# EAGLE design logger_2G_GSM (EAGLE 6.6.0)
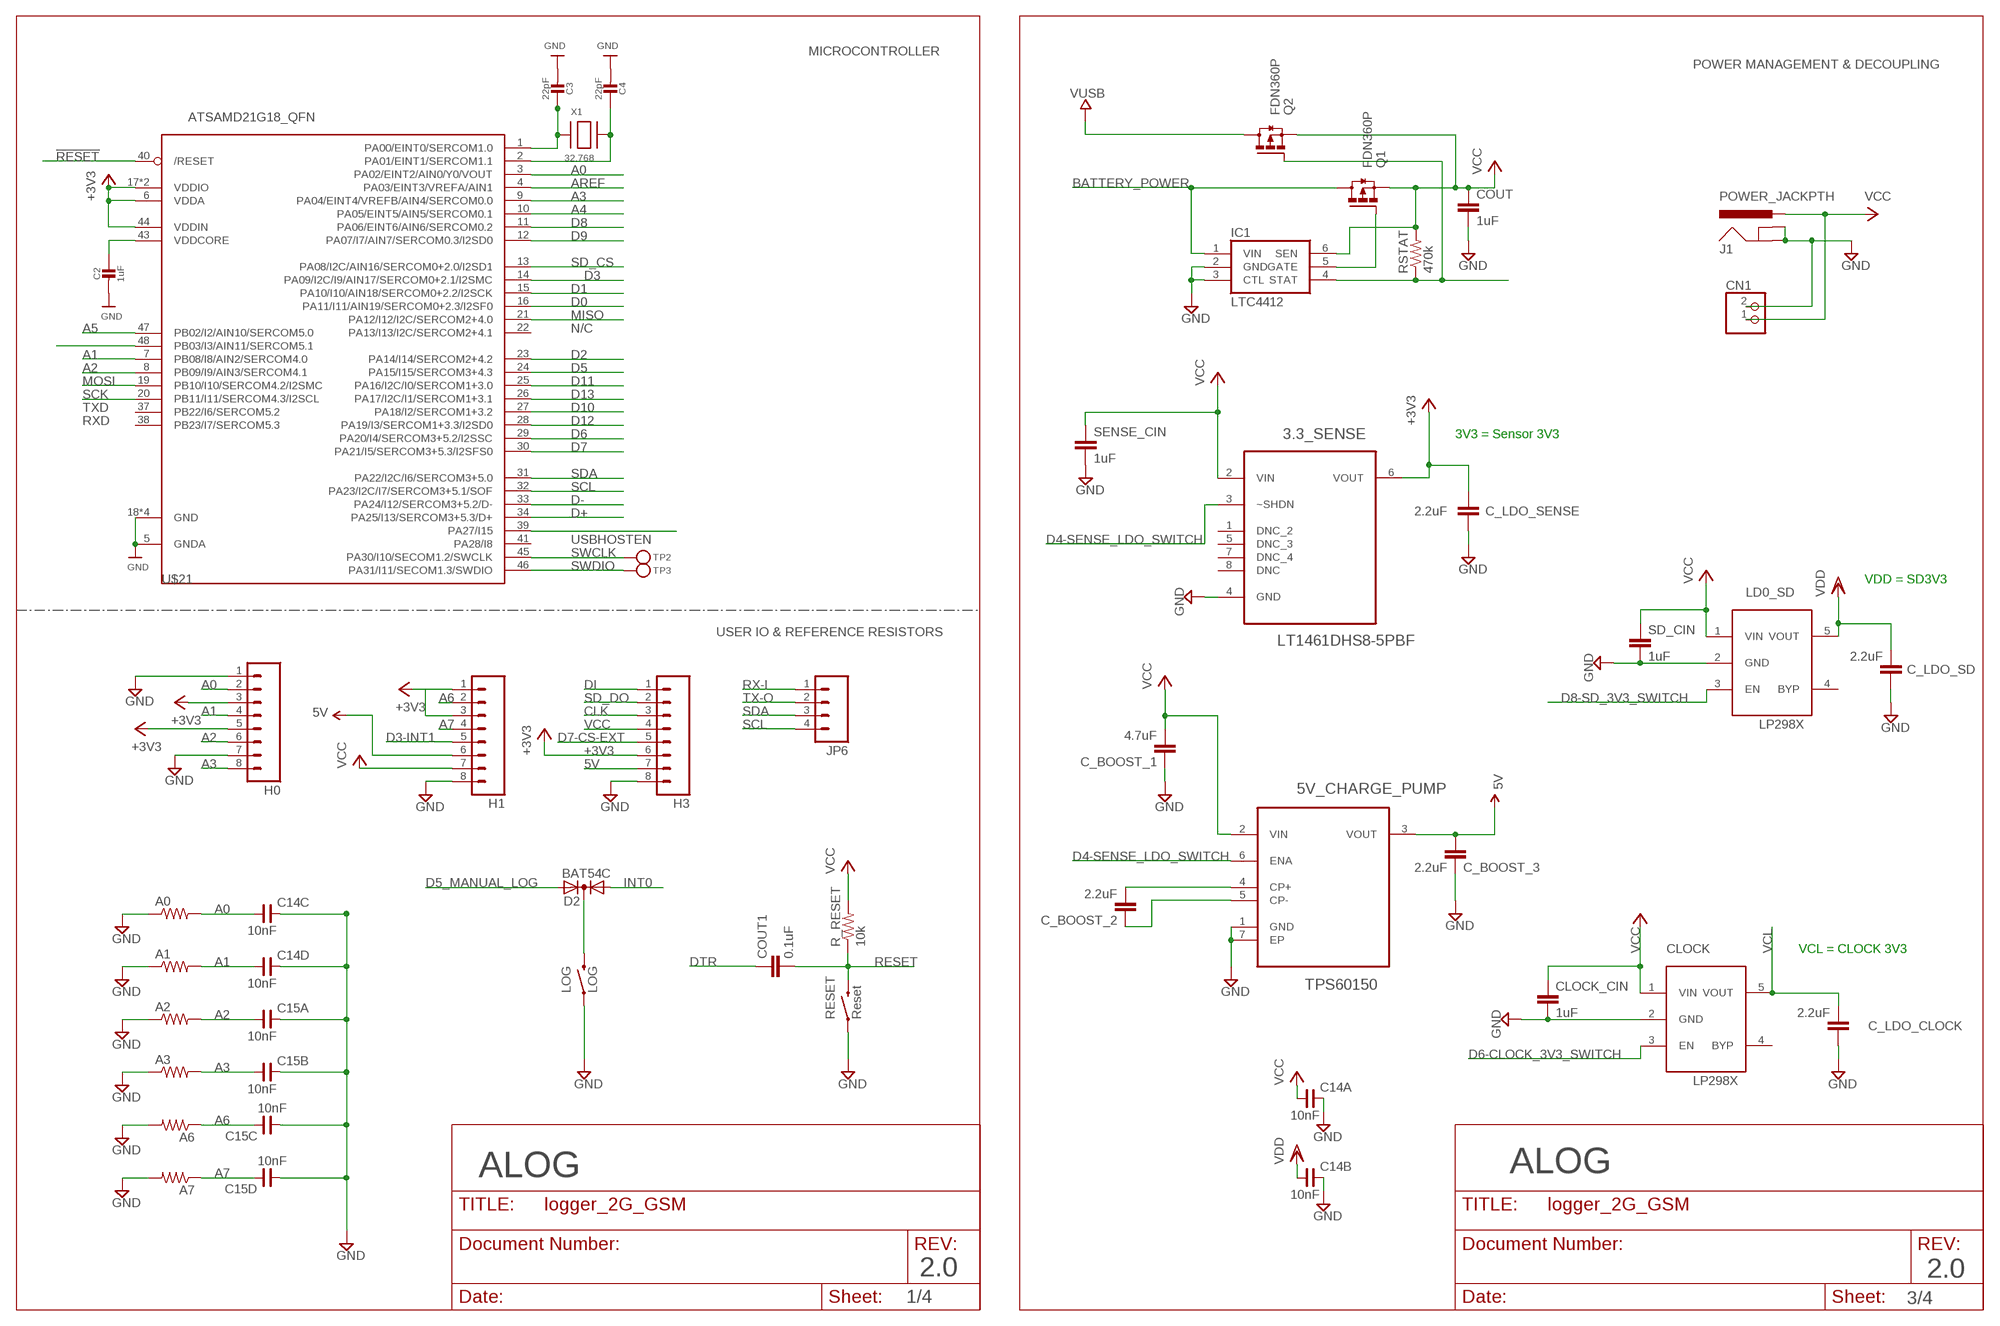
[diagram p0: schematic, sheet 1, part 1 of 3]
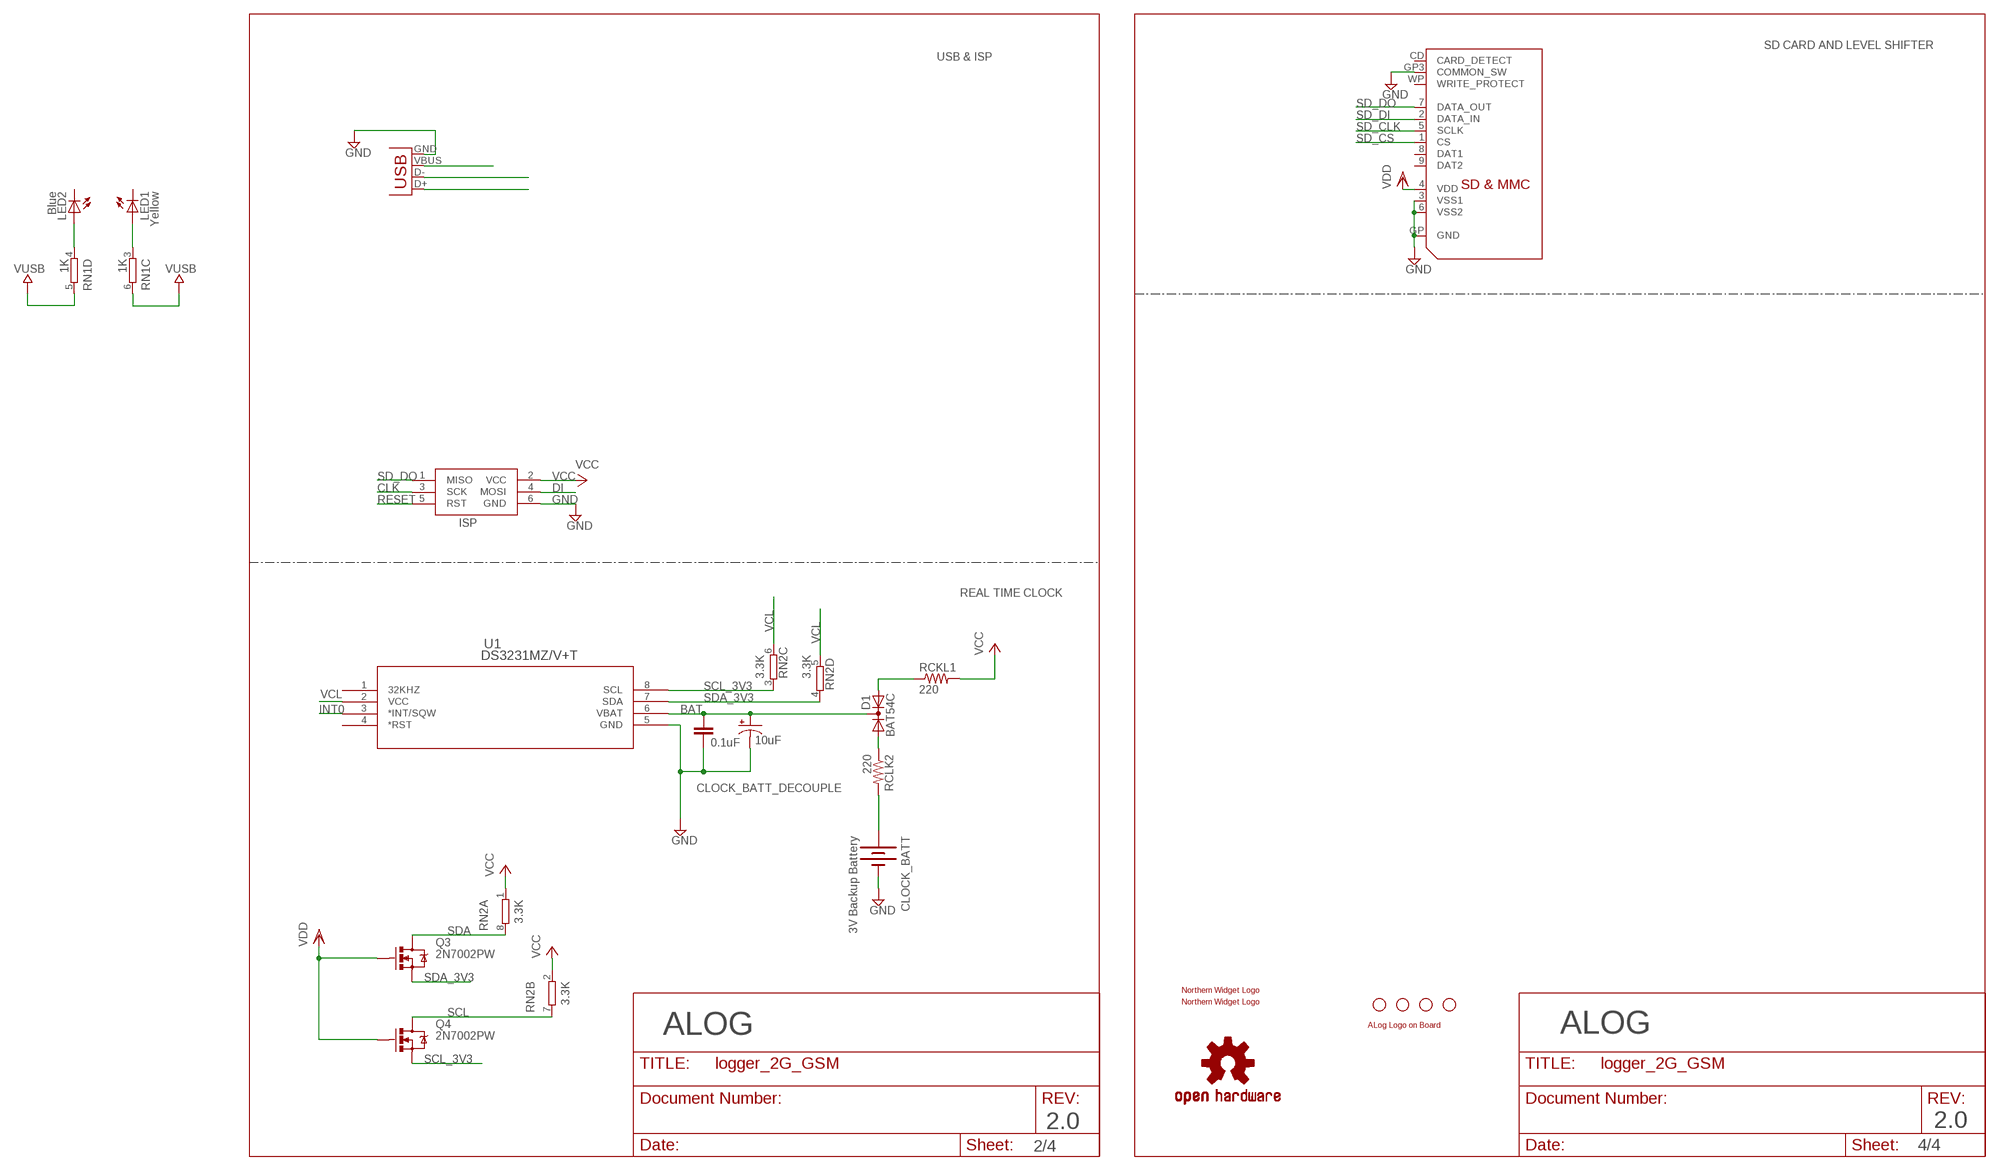
[diagram p1: schematic, sheet 1, part 2 of 3]
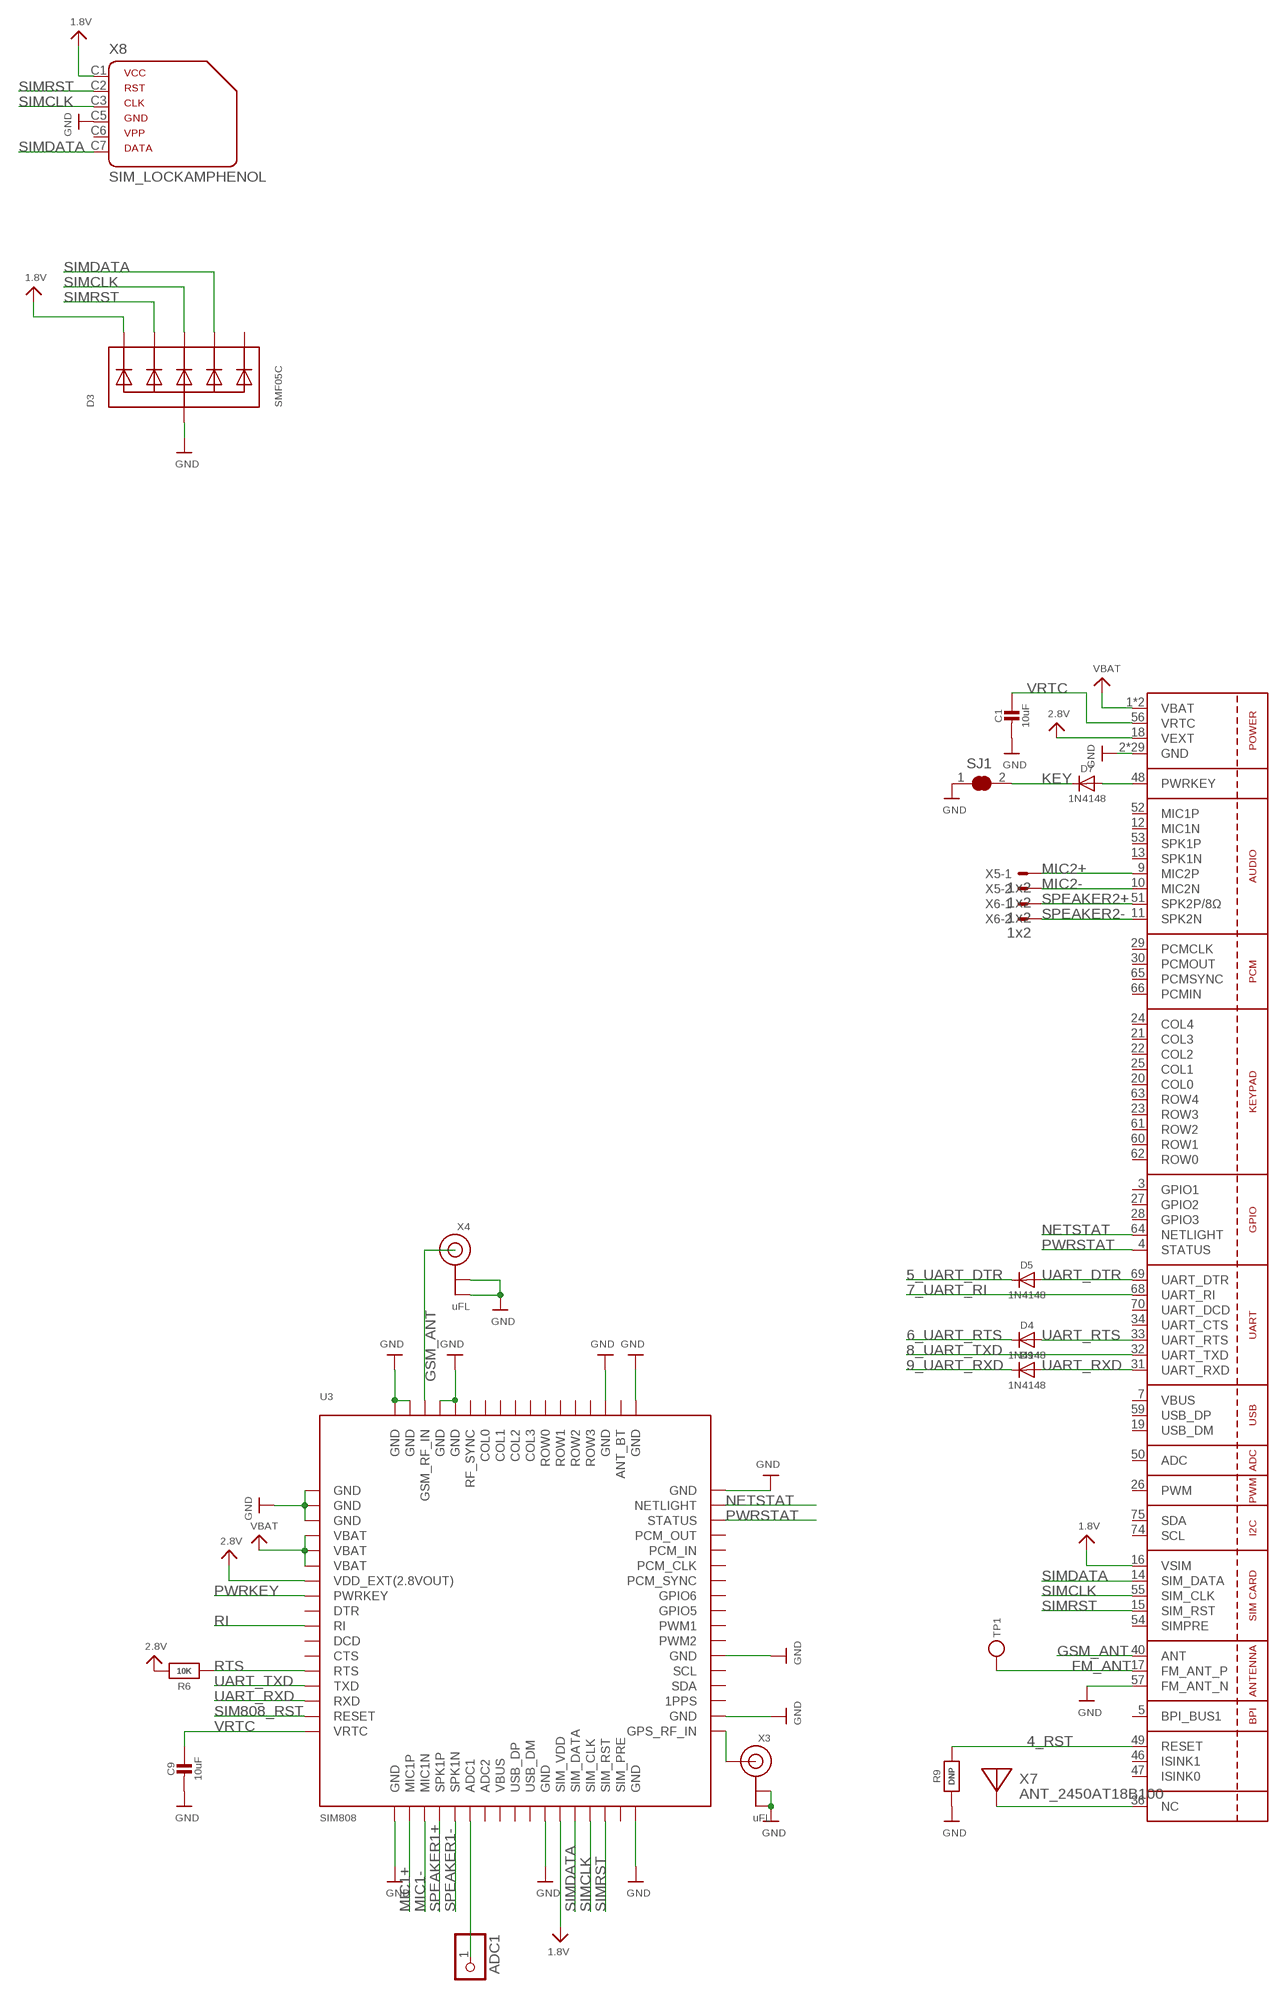
[diagram p2: schematic, sheet 1, part 3 of 3]

## Parts
3.3_SENSE  LT1461DHS8-5PBF  [SOIC127P600X175-8N]
5V_CHARGE_PUMP  TPS60150  TPS60150DRVR  [SON65P200X200X80-7N]
A0  R-US_0207/10  [0207/10]
A1  R-US_0207/10  [0207/10]
A2  R-US_0207/10  [0207/10]
A3  R-US_0207/10  [0207/10]
A6  R-US_0207/10  [0207/10]
A7  R-US_0207/10  [0207/10]
ADC1  PINHD-1X1CB  [1X01-CLEANBIG]
C1  10uF  CAP_CERAMIC_0805MP  [_0805MP]
C2  1uF  CAP_CERAMIC0603_NO  [0603-NO]
C3  22pF  CAP_CERAMIC0603_NO  [0603-NO]
C4  22pF  CAP_CERAMIC0603_NO  [0603-NO]
C9  10uF  CAP_CERAMIC0805-NOOUTLINE  [0805-NO]
C14  10nF  CCA_ECJ-1206  [CECJ-1206]
C15  10nF  CCA_ECJ-1206  [CECJ-1206]
C_BOOST_1  4.7uF  C-EUC0603  [C0603]
C_BOOST_2  2.2uF  C-EUC0603  [C0603]
C_BOOST_3  2.2uF  C-EUC0603  [C0603]
C_LDO_CLOCK  2.2uF  C-EUC0603  [C0603]
C_LDO_SD  2.2uF  C-EUC0603  [C0603]
C_LDO_SENSE  2.2uF  C-EUC0603  [C0603]
CLOCK  LP2985  LP298XS  [SOT23-5L]
CLOCK_BATT  3V Backup Battery  BATTERY12PTH  [BATTCON_12MM_PTH]
CLOCK_BATT_DECOUP  0.1uF  C-EUC0603  [C0603]
CLOCK_BATT_DECOUPLE  10uF  CAP_POL1206  [EIA3216]
CLOCK_CIN  1uF  C-EUC0603  [C0603]
CN1  JST_2PIN-THM  [JST-PH-2-THM]
COUT  1uF  C-EUC0603  [C0603]
COUT1  0.1uF  C-EUC0603  [C0603]
D1  BAT54C  DIODE_AC-CA_  [SOT23C]
D2  BAT54C  DIODE_AC-CA_  [SOT23C]
D3  SMF05C  TVSARRAY_5LANE  [SOT363]
D4  1N4148  DIODESOD-323  [SOD-323]
D5  1N4148  DIODESOD-323  [SOD-323]
D7  1N4148  DIODESOD-323  [SOD-323]
D9  1N4148  DIODESOD-323  [SOD-323]
H0  M083.5MM-8  [SCREWTERMINAL-3.5MM-8]
H1  M083.5MM-8  [SCREWTERMINAL-3.5MM-8]
H3  M083.5MM-8  [SCREWTERMINAL-3.5MM-8]
IC1  LTC4412  LTC4412ES6  [TSOT23-6]
ISP  AVRISP-6  [AVRISP]
J1  POWER_JACKPTH  [POWER_JACK_PTH]
JP1  STAND-OFF  [STAND-OFF]
JP2  STAND-OFF  [STAND-OFF]
JP3  STAND-OFF  [STAND-OFF]
JP4  STAND-OFF  [STAND-OFF]
JP5  USB-B  USBPTH  [USB-B-PTH]
JP6  M04SCREW  [SCREWTERMINAL-3.5MM-4]
LD0_SD  LP2985  LP298XS  [SOT23-5L]
LED1  Yellow  LED0603  [LED-0603]
LED2  Blue  LED0603  [LED-0603]
LOG  LOG  SWITCH-MOMENTARY-2PTH  [TACTILE-PTH]
LOGO1  OSHW-LOGOM  [OSHW-LOGO-M]
Q1  FDN360P  [SUPER-SOT3]
Q2  FDN360P  [SUPER-SOT3]
Q3  2N7002PW  MOSFET-NCHANNELSOT323  [SOT323]
Q4  2N7002PW  MOSFET-NCHANNELSOT323  [SOT323]
R6  10K  RESISTOR0805_NOOUTLINE  [0805-NO]
R9  DNP  RESISTOR_0603_NOOUT  [0603-NO]
R_RESET  10k  R-US_R0603  [R0603]
RCKL1  220  R-US_R0603  [R0603]
RCLK2  220  R-US_R0603  [R0603]
RESET  Reset  SWITCH-MOMENTARY-2PTH  [TACTILE-PTH]
RN1  1K  4R-N0603-ARC  [0603-ARC]
RN2  3.3K  4R-N0603-ARC  [0603-ARC]
RSTAT  470k  R-US_R0603  [R0603]
SD  SDMMC06132  [06132]
SD_CIN  1uF  C-EUC0603  [C0603]
SENSE_CIN  1uF  C-EUC0603  [C0603]
SJ1  SOLDERJUMPER_CLOSED  [SOLDERJUMPER_CLOSEDWIRE]
TP1  TESTPOINTROUND1.5MM  [TESTPOINT_ROUND_1.5MM]
TP2  TESTPOINTROUND1.5MM  [TESTPOINT_ROUND_1.5MM]
TP3  TESTPOINTROUND1.5MM  [TESTPOINT_ROUND_1.5MM]
U1  DS3231MZ/V+T  [21-0041B_8]
U2  SIM800H/L  GSM_SIM800L  [SIM800L]
U3  SIM808  GSM_SIM808_LITERAL  [SIM900_SMT]
U$1  NWLOGO  [NWLOGO]
U$2  ALOG_LOGO_V1_5.5MM  [ALOG_LOGO_V1_SMALL]
U$3  NWLOGO_MED  [NWLOGO_MED]
U$21  ATSAMD21G18_QFN  ATSAMD21J_QFN  [TQFN48_7MM]
X1  32.768  XTAL-3.2X1.5  [XTAL3215]
X3  uFL  ANTENNA_U.FL  [U.FL]
X4  uFL  ANTENNA_U.FL  [U.FL]
X5  1x2  87758-0216  [87758-0216]
X6  1x2  87758-0216  [87758-0216]
X7  ANT_2450AT18B100  ANTENNA_JOHANSON_2450AT18B100  [ANT_2450AT18B100]
X8  SIM_LOCKAMPHENOL  [C707_10M006_512_2]

## Nets
1.8V: D3.1(C1) U2.16(VSIM) U3.P$29(SIM_VDD) X8.C1
2.8V: R6.2 U2.18(VEXT) U3.P$7(VDD_EXT(2.8VOUT))
4_RST: R9.2 U2.49(RESET)
5_UART_DTR: D5.C
5V: 5V_CHARGE_PUMP.3(VOUT) C_BOOST_3.2 H1.6 H3.7
6_UART_RTS: D4.C
7_UART_RI: U2.68(UART_RI)
8_UART_TXD: U2.32(UART_TXD)
9_UART_RXD: D9.C
!RESET: U$21.40(/RESET)
+3V3: 3.3_SENSE.6(VOUT) C_LDO_SENSE.2 H0.3 H0.5 H1.1 H1.3 H3.6 U$21.6(VDDA) U$21.17(VDDIO) U$21.36(VDDIO) U$21.44(VDDIN)
A0: A0.2 C14.C1 H0.2 U$21.3(PA02/EINT2/AIN0/Y0/VOUT)
A1: A1.2 C14.D1 H0.4 U$21.7(PB08/I8/AIN2/SERCOM4.0)
A2: A2.2 C15.A1 H0.6 U$21.8(PB09/I9/AIN3/SERCOM4.1)
A3: A3.2 C15.B1 H0.8 U$21.9(PA04/EINT4/VREFB/AIN4/SERCOM0.0)
A4: U$21.10(PA05/EINT5/AIN5/SERCOM0.1)
A5: U$21.47(PB02/I2/AIN10/SERCOM5.0)
A6: A6.1 C15.C2 H1.2
A7: A7.1 C15.D2 H1.4
AREF: U$21.4(PA03/EINT3/VREFA/AIN1)
BAT: CLOCK_BATT_DECOUP.1 CLOCK_BATT_DECOUPLE.A(+) D1.3(K) U1.6(VBAT)
BATTERY_POWER: IC1.1(VIN) Q1.3(D)
CLK: H3.3 ISP.3(SCK)
D0: U$21.16(PA11/I11/AIN19/SERCOM0+2.3/I2SF0)
D1: U$21.15(PA10/I10/AIN18/SERCOM0+2.2/I2SCK)
D2: U$21.23(PA14/I14/SERCOM2+4.2)
D3: U$21.14(PA09/I2C/I9/AIN17/SERCOM0+2.1/I2SMC)
D3-INT1: H1.5
D4-SENSE_LDO_SWITCH: 3.3_SENSE.3(~SHDN) 5V_CHARGE_PUMP.6(ENA)
D5: U$21.24(PA15/I15/SERCOM3+4.3)
D5_MANUAL_LOG: D2.2(A2)
D6: U$21.29(PA20/I4/SERCOM3+5.2/I2SSC)
D6-CLOCK_3V3_SWITCH: CLOCK.3(EN)
D7: U$21.30(PA21/I5/SERCOM3+5.3/I2SFS0)
D7-CS-EXT: H3.5
D8: U$21.11(PA06/EINT6/AIN6/SERCOM0.2)
D8-SD_3V3_SWITCH: LD0_SD.3(EN)
D9: U$21.12(PA07/I7/AIN7/SERCOM0.3/I2SD0)
D10: U$21.27(PA18/I2/SERCOM1+3.2)
D11: U$21.25(PA16/I2C/I0/SERCOM1+3.0)
D12: U$21.28(PA19/I3/SERCOM1+3.3/I2SD0)
D13: U$21.26(PA17/I2C/I1/SERCOM1+3.1)
D+: U$21.34(PA25/I13/SERCOM3+5.3/D+)
D-: U$21.33(PA24/I12/SERCOM3+5.2/D-)
DI: H3.1 ISP.4(MOSI)
DTR: COUT1.1
FM_ANT: TP1.P$1 U2.17(FM_ANT_P)
GND: 3.3_SENSE.4(GND) 5V_CHARGE_PUMP.1(GND) 5V_CHARGE_PUMP.7(EP) A0.1 A1.1 A2.1 A3.1 A6.2 A7.2 C1.2 C2.2 C3.2 C4.2 C9.2 C14.A2 C14.B2 C14.C2 C14.D2 C15.A2 C15.B2 C15.C1 C15.D1 C_BOOST_1.1 C_BOOST_3.1 C_LDO_CLOCK.1 C_LDO_SD.1 C_LDO_SENSE.1 CLOCK.2(GND) CLOCK_BATT.GND(-) CLOCK_BATT_DECOUP.2 CLOCK_BATT_DECOUPLE.C(-) CLOCK_CIN.2 CN1.2 COUT.2 D3.2(A) H0.1 H0.7 H1.8 H3.8 IC1.2(GND) IC1.3(CTL) ISP.6(GND) J1.GND J1.GNDBREAK JP5.GND LD0_SD.2(GND) LOG.1 R9.1 RESET.1 SD.3(VSS1) SD.6(VSS2) SD.GP3(COMMON_SW) SD.GP(GND) SD_CIN.2 SENSE_CIN.2 SJ1.1 U1.5(GND) U2.2(GND) U2.6(GND) U2.8(GND) U2.35(GND) U2.37(GND) U2.38(GND) U2.39(GND) U2.41(GND) U2.43(GND) U2.44(GND) U2.45(GND) U2.57(FM_ANT_N) U2.58(GND) U2.67(GND) U2.71(GND) U2.72(GND) U2.73(GND) U2.76(GND) U2.77(GND) U2.78(GND) U2.79(GND) U2.80(GND) U2.81(GND) U2.82(GND) U2.83(GND) U2.84(GND) U2.85(GND) U2.86(GND) U2.87(GND) U2.88(GND) U3.P$1(GND) U3.P$2(GND) U3.P$3(GND) U3.P$18(GND) U3.P$28(GND) U3.P$34(GND) U3.P$36(GND) U3.P$40(GND) U3.P$51(GND) U3.P$52(GND) U3.P$54(GND) U3.P$64(GND) U3.P$65(GND) U3.P$67(GND) U3.P$68(GND) U$21.5(GNDA) U$21.18(GND) U$21.35(GND) U$21.42(GND) U$21.THERMAL(GND) X3.1(GND) X3.2(GND) X4.1(GND) X4.2(GND) X8.C5
GSM_ANT: U2.40(ANT) U3.P$66(GSM_RF_IN) X4.3(SIGNAL)
INT0: D2.1(A1) U1.3(*INT/SQW)
KEY: D7.C SJ1.2
MIC1+: U3.P$19(MIC1P)
MIC1-: U3.P$20(MIC1N)
MIC2+: U2.9(MIC2P) X5.1
MIC2-: U2.10(MIC2N) X5.2
MISO: U$21.21(PA12/I12/I2C/SERCOM2+4.0)
MOSI: U$21.19(PB10/I10/SERCOM4.2/I2SMC)
N$1: D1.1(A1) RCLK2.1
N$2: CLOCK_BATT.VCC@1(+) RCLK2.2
N$3: JP5.D+
N$4: JP5.D-
N$5: LED2.A RN1.4
N$6: U3.P$35(GPS_RF_IN) X3.3(SIGNAL)
N$7: IC1.4(STAT) Q2.1(G) RSTAT.1
N$8: IC1.5(GATE) Q1.1(G)
N$9: LED1.A RN1.3
N$10: ADC1.1 U3.P$23(ADC1)
N$11: D2.3(K) LOG.3
N$13: U2.36(NC) X7.FP
N$14: 5V_CHARGE_PUMP.4(CP+) C_BOOST_2.2
N$15: 5V_CHARGE_PUMP.5(CP-) C_BOOST_2.1
N$16: D7.A U2.48(PWRKEY)
N$17: C3.1 U$21.1(PA00/EINT0/SERCOM1.0) X1.P$1
N$18: JP5.VBUS
N$19: C4.1 U$21.2(PA01/EINT1/SERCOM1.1) X1.P$2
N$20: U$21.48(PB03/I3/AIN11/SERCOM5.1)
N$21: U$21.39(PA27/I15)
N$67: D1.2(A2) RCKL1.1
NETSTAT: U2.64(NETLIGHT) U3.P$50(NETLIGHT)
PWRKEY: U3.P$8(PWRKEY)
PWRSTAT: U2.4(STATUS) U3.P$49(STATUS)
RESET: COUT1.2 ISP.5(RST) R_RESET.1 RESET.3
RI: U3.P$10(RI)
RTS: R6.1 U3.P$13(RTS)
RX-I: JP6.1
SCK: U$21.20(PB11/I11/SERCOM4.3/I2SCL)
SCL: JP6.4 Q4.3(D) RN2.7 U$21.32(PA23/I2C/I7/SERCOM3+5.1/SOF)
SCL_3V3: Q4.2(S) RN2.3 U1.8(SCL)
SD_CLK: SD.5(SCLK)
SD_CS: SD.1(CS) U$21.13(PA08/I2C/AIN16/SERCOM0+2.0/I2SD1)
SD_DI: SD.2(DATA_IN)
SD_DO: H3.2 ISP.1(MISO) SD.7(DATA_OUT)
SDA: JP6.3 Q3.3(D) RN2.8 U$21.31(PA22/I2C/I6/SERCOM3+5.0)
SDA_3V3: Q3.2(S) RN2.4 U1.7(SDA)
SIM808_RST: U3.P$16(RESET)
SIMCLK: D3.4(C3) U2.55(SIM_CLK) U3.P$31(SIM_CLK) X8.C3
SIMDATA: D3.5(C4) U2.14(SIM_DATA) U3.P$30(SIM_DATA) X8.C7
SIMRST: D3.3(C2) U2.15(SIM_RST) U3.P$32(SIM_RST) X8.C2
SPEAKER1+: U3.P$21(SPK1P)
SPEAKER1-: U3.P$22(SPK1N)
SPEAKER2+: U2.51(SPK2P/8Ω) X6.1
SPEAKER2-: U2.11(SPK2N) X6.2
SWCLK: TP2.P$1 U$21.45(PA30/I10/SECOM1.2/SWCLK)
SWDIO: TP3.P$1 U$21.46(PA31/I11/SECOM1.3/SWDIO)
TX-O: JP6.2
UART_DTR: D5.A U2.69(UART_DTR)
UART_RTS: D4.A U2.33(UART_RTS)
UART_RXD: D9.A U2.31(UART_RXD) U3.P$15(RXD)
UART_TXD: U3.P$14(TXD)
VBAT: U2.1(VBAT) U2.42(VBAT) U3.P$4(VBAT) U3.P$5(VBAT) U3.P$6(VBAT)
VCC: 3.3_SENSE.2(VIN) 5V_CHARGE_PUMP.2(VIN) C14.A1 C_BOOST_1.2 CLOCK.1(VIN) CLOCK_CIN.1 CN1.1 COUT.1 H1.7 H3.4 IC1.6(SEN) ISP.2(VCC) J1.PWR LD0_SD.1(VIN) Q1.2(S) Q2.2(S) R_RESET.2 RCKL1.2 RN2.1 RN2.2 RSTAT.2 SD_CIN.1 SENSE_CIN.1
VCL: C_LDO_CLOCK.2 CLOCK.5(VOUT) RN2.5 RN2.6 U1.2(VCC)
VDD: C14.B1 C_LDO_SD.2 LD0_SD.5(VOUT) Q3.1(G) Q4.1(G) SD.4(VDD)
VDDCORE: C2.1 U$21.43(VDDCORE)
VRTC: C1.1 C9.1 U2.56(VRTC) U3.P$17(VRTC)
VUSB: Q2.3(D) RN1.5 RN1.6
Unconnected: 3.3_SENSE.1(DNC_2) 3.3_SENSE.5(DNC_3) 3.3_SENSE.7(DNC_4) 3.3_SENSE.8(DNC) CLOCK.4(BYP) D3.6(C5) LD0_SD.4(BYP) LED1.C LED2.C RN1.1 RN1.2 RN1.7 RN1.8 SD.8(DAT1) SD.9(DAT2) SD.CD(CARD_DETECT) SD.WP(WRITE_PROTECT) U1.1(32KHZ) U1.4(*RST) U2.3(GPIO1) U2.5(BPI_BUS1) U2.12(MIC1N) U2.13(SPK1N) U2.19(USB_DM) U2.20(COL0) U2.21(COL3) U2.22(COL2) U2.23(ROW3) U2.24(COL4) U2.25(COL1) U2.26(PWM) U2.27(GPIO2) U2.28(GPIO3) U2.29(PCMCLK) U2.30(PCMOUT) U2.34(UART_CTS) U2.46(ISINK1) U2.47(ISINK0) U2.50(ADC) U2.52(MIC1P) U2.53(SPK1P) U2.54(SIMPRE) U2.59(USB_DP) U2.60(ROW1) U2.61(ROW2) U2.62(ROW0) U2.63(ROW4) U2.65(PCMSYNC) U2.66(PCMIN) U2.70(UART_DCD) U2.74(SCL) U2.75(SDA) U3.P$9(DTR) U3.P$11(DCD) U3.P$12(CTS) U3.P$24(ADC2) U3.P$26(USB_DP) U3.P$27(USB_DM) U3.P$33(SIM_PRE) U3.P$37(1PPS) U3.P$38(SDA) U3.P$39(SCL) U3.P$41(PWM2) U3.P$42(PWM1) U3.P$43(GPIO5) U3.P$44(GPIO6) U3.P$45(PCM_SYNC) U3.P$46(PCM_CLK) U3.P$47(PCM_IN) U3.P$48(PCM_OUT) U3.P$53(ANT_BT) U3.P$55(ROW3) U3.P$56(ROW2) U3.P$57(ROW1) U3.P$58(ROW0) U3.P$59(COL3) U3.P$60(COL2) U3.P$61(COL1) U3.P$62(COL0) U3.P$63(RF_SYNC) U$21.22(PA13/I13/I2C/SERCOM2+4.1) U$21.37(PB22/I6/SERCOM5.2) U$21.38(PB23/I7/SERCOM5.3) U$21.41(PA28/I8) X8.C6

## Notes on the sheet
- MICROCONTROLLER
- POWER MANAGEMENT & DECOUPLING
- N/C
- TXD
- RXD
- 3V3 = Sensor 3V3
- USBHOSTEN
- VDD = SD3V3
- USER IO & REFERENCE RESISTORS
- VCL = CLOCK 3V3
- ALOG | ALOG
- 2.0 | 2.0
- 1/4 | 3/4
- SD CARD AND LEVEL SHIFTER
- USB & ISP
- REAL TIME CLOCK
- ALOG | ALOG
- 2.0 | 2.0
- 2/4 | 4/4

## Power pins joined to a net without a drawn wire
VBUS: U2.7(VBUS) U3.P$25(VBUS)

## Library data of the parts
3.3_SENSE = LTC_By_element14_Batch_1:LT1461DHS8-5PBF: Micropower Precision Low Dropout Series Voltage Reference Family; MPN: LT1461DHS8-5#PBF; OC_FARNELL: 1663431; OC_NEWARK: 57M4326; PACKAGE: SOIC-8; SUPPLIER: Linear Technology
5V_CHARGE_PUMP = ti_by_element14:TPS60150DRVR: Charge Pump Device; MPN: TPS60150DRVR; OC_FARNELL: -; OC_NEWARK: 45P8283; PACKAGE: SON-6; SUPPLIER: Texas Instruments
A0 A1-A3 A6 A7 = resistor:R-US_: RESISTOR, American symbol
ADC1 = adafruit:PINHD-1X1: Pin header 1x1 for 0.1" spacing With round pins
C1-C4 C9 = microbuilder:CAP_CERAMIC: Ceramic Capacitors For new designs, use the packages preceded by an '_' character since they are more reliable: The following footprints should be used on most boards: _0402 - Standard footprint for regular board layouts _0603 - Standard footprint for regular board layouts _0805 - Standard footprint for regular board layouts _1206 - Standard footprint for regular board layouts For extremely tight-pitch boards where space is at a premium, the following 'micro-pitch' footprints can be used (smaller pads, no silkscreen outline, etc.): _0402MP - Micro-pitch footprint for very dense/compact boards _0603MP - Micro-pitch footprint for very dense/compact boards _0805MP - Micro-pitch footprint for very dense/compact boards _1206MP - Micro-pitch footprint for very dense/compact boards
C14 C15 = rc-master-smd:CCA_: CHIP CAP ARRAY
C_BOOST_1-C_BOOST_3 C_LDO_CLOCK C_LDO_SD C_LDO_SENSE = resistor:C-EU: CAPACITOR, European symbol
CLOCK LD0_SD = adafruit:LP298X
CLOCK_BATT = SparkFun:BATTERY: Battery Holders Various common sizes : AA, AAA, 20mm coin cell and 12mm coin cell.
CLOCK_BATT_DECOUP CLOCK_CIN COUT COUT1 SD_CIN SENSE_CIN = rcl:C-EU: CAPACITOR, European symbol
CLOCK_BATT_DECOUPLE = SparkFun-Passives:CAP_POL: Capacitor Polarized These are standard SMD and PTH capacitors. Normally 10uF, 47uF, and 100uF in electrolytic and tantalum varieties. Always verify the external diameter of the through hole cap, it varies with capacity, voltage, and manufacturer. The EIA devices should be standard.
CN1 = adafruit:JST_2PIN: JST 2-Pin Connectors of various flavors SMT-RA (S2B-PH-SM4) 4UConnector #17311 SMT (B2B-PH-SM4) THM-RA (S2B-PH) THM (B2B-PH)
D1 D2 = semicon-smd-ipc:DIODE_AC-CA_: DUAL DIODE
D3 = microbuilder:TVSARRAY_5LANE: Voltage Transient Suppressor Array SOT363 SMF05C - 100W 5V: Digikey - SMF05CT1GOSCT-ND
D4 D5 D7 D9 = microbuilder:DIODE: Diode SMA Model Volts Amps Type Vf Ir Digikey # Notes SSA34-E3 40V 3A Schottky 480mV @ 3A 200uA @ 40V SSA34-E3/61TGITR-ND CDBA120-G 20V 1A Schottky 500mV @ 1A 500uA @ 20V 641-1014-6-ND REEL MBRA210 10V 2A Schottky 350mV @ 2A 700uA @ 10V MBRA210LT3 SOD-123 Model Volts Amps Type Vf Ir Order # Notes BAT54T1G 30V 200mA Schottky 800mV @ 200mA 2uA @ 25V BAT54T1GOSTR-ND B0530W 30V 500mA Schottky 430mV @ 500mA 130uA @ 30V B0530W-FDICT-ND REEL MBR120 20V 1A Schottky 340mV @ 1A MBR120VLSFT1GOSCT-ND SOD-323 Model Volts Amps Type Vf Ir Order # Notes PMEG2005EJ 20V 500mA Schottky 355mV @ 500mA 568-4110-1-ND ZLLS410 10V 570mA Schottky 380mV @ 570mA ZLLS410CT-ND 1N4148WS 75V 150mA Silicon/Simple 1V 1N4148WSFSCT-ND REEL SOD-523 Model Volts Amps Type Vf Ir Order # Notes BAT54XV2 30V 200mA Schottky 0.8V @ 100mA BAT54XV2CT-ND TB751S 30V 30mA Schottky RB751S-40TE61CT-ND SOT23-R/W (R = Solder Paste/Reflow Ovens, W = Hand-Soldering) Model Volts Amps Type Vf Ir Order # Notes BAT54FILM 40V 300mA Schottky 497-7162-1-ND POWERDI-5 Model Volts Amps Type Vf Ir Order # Notes PDS560 60V 5A Schottky 670mV @ 5A 150uA @ 60V PDS560DICT-ND
H0 H1 H3 = SparkFun:M08: Header 8 Standard 8-pin 0.1" header. Use with straight break away headers (SKU : PRT-00116), right angle break away headers (PRT-00553), swiss pins (PRT-00743), machine pins (PRT-00117), and female headers (PRT-00115).
IC1 = awickert:LTC4412*: Low Loss PowerPath Controller
ISP = adafruit:AVRISP: AVR ISP HEADER Standard 6 pin header for AVR programming
J1 = SparkFun:POWER_JACK: Power Jack This is the standard 5.5mm barrel jack for power. The PTH is the most common, proven, reliable, footprint. All others are experimental. The Slot footprint only works if the mill layer is transmitted to the PCB fab house so be warned. Spark Fun Electronics SKU : PRT-00119. Mating wall wart : TOL-00298 (and others)
JP1-JP4 = SparkFun:STAND-OFF: Stand Off This is the mechanical footprint for a #4 phillips button head screw. Use the keepout ring to avoid running the screw head into surrounding components. SKU : PRT-00447
JP5 = SparkFun-Connectors:USB: USB Connectors USB-B-PTH is fully proven SKU : PRT-00139/CONN-08278 USB-miniB is fully proven SKU : PRT-00587 USB-A-PCB is untested. USB-A-H is throughly reviewed, but untested. Spark Fun Electronics SKU : PRT-00437 USB-B-SMT is throughly reviewed, but untested. Needs silkscreen touching up. USB-A-S has not been used/tested USB-MB-H has not been used/tested USB-MICROB has been used. CONN-09505; PROD_ID: CONN-08278
JP6 = SparkFun-Connectors:M04: Header 4 Standard 4-pin 0.1" header. Use with straight break away headers (SKU : PRT-00116), right angle break away headers (PRT-00553), swiss pins (PRT-00743), machine pins (PRT-00117), and female headers (PRT-00115). Molex polarized connector foot print use with SKU : PRT-08231 with associated crimp pins and housings. 1MM SMD Version SKU: PRT-10208; PROD_ID: Combine 2x8399
LED1 LED2 = SparkFun-LED:LED: LEDs Standard schematic elements and footprints for 5mm, 3mm, 1206, and 0603 sized LEDs. 5mm - Spark Fun Electronics SKU : COM-00529 (and others)
LOG RESET = SparkFun-Electromechanical:SWITCH-MOMENTARY-2: Various NO switches- pushbuttons, reed, etc; PROD_ID: SWCH-08441
LOGO1 = SparkFun-Aesthetics:OSHW-LOGO: Open Source Hardware Logo This logo indicates the piece of hardware it is found on incorporates a OSHW license and/or adheres to the definition of open source hardware found here: http://freedomdefined.org/OSHW
Q1 Q2 = transistor-power:FDN360P: Single P-Channel, PowerTrench (R) MOSFET Source: http://www.fairchildsemi.com/ds/FD/FDN360P.pdf
Q3 Q4 = SparkFun-DiscreteSemi:MOSFET-NCHANNEL: Generic NMOS footprint
R6 R9 = microbuilder:RESISTOR: Resistors For new designs, use the packages preceded by an '_' character since they are more reliable: The following footprints should be used on most boards: _0402 - Standard footprint for regular board layouts _0603 - Standard footprint for regular board layouts _0805 - Standard footprint for regular board layouts _1206 - Standard footprint for regular board layouts For extremely tight-pitch boards where space is at a premium, the following 'micro-pitch' footprints can be used (smaller pads, no silkscreen outline, etc.): _0402MP - Micro-pitch footprint for very dense/compact boards _0603MP - Micro-pitch footprint for very dense/compact boards _0805MP - Micro-pitch footprint for very dense/compact boards _1206MP - Micro-pitch footprint for very dense/compact boards
R_RESET RCKL1 RCLK2 RSTAT = rcl:R-US_: RESISTOR, American symbol
RN1 RN2 = resistor-dil:4R-N: Array Chip Resistor Source: RS Component / Phycomp; OC_FARNELL: unknown; OC_NEWARK: unknown
SD = adafruit:SDMMC: SD MMC Card holder 4UCON part #06132 - easy to solder
SJ1 = microbuilder:SOLDERJUMPER_CLOSED: Solder Jumper - Closed These solder jumpers are closed by default CLOSEDWIRE - 10 mil trace between pads that can be cut and resoldered later CLOSEDPERM - 63 mil trace between pads for a permanent connection (used to 'bridge' two signals, a shameless hack for Eagle). Can double as a test point as well (no cream layer)
TP1-TP3 = microbuilder:TESTPOINT: Test Point Various test points for characterisation and PCB testing TESTPOINT_SMT - Compact Surface Mount Test Point [Digikey: 5016KTR-ND]
U1 = Maxim-DS3231MZ_8-SOIC:DS3231MZ/V+T; MANUFACTURER_NAME: Maxim; MANUFACTURER_PART_NUMBER: DS3231MZ/V+T; VENDOR: Maxim
U2 = microbuilder:GSM_SIM800L: SIM800K Quad-Band GSM/GPRS Module 850/900/1800/1900 MHz Bluetooth EDR (3.0) FM Band: 76-109MHz (50kHz steps) -40 - 85°C
U3 = microbuilder:GSM_SIM808_LITERAL: SIM808 GSM Module
U$1 = awickert:NWLOGO
U$2 = awickert:ALOG_LOGO_V1_5.5MM
U$3 = awickert:NWLOGO_MED: Medium-sized Northern Widget logo
U$21 = microbuilder:ATSAMD21J
X1 = adafruit2:XTAL: Low cost SMT crystals, no capacitors included http://www.ladyada.net/library/eagle
X3 X4 = microbuilder:ANTENNA_U.FL: U.FL Antenna Connector
X5 X6 = con-molex:87758-0216: 2 Pin - 2mm Dual Row Single Wafer, Vertical T/H HDR Source: http://www.molex.com/pdm_docs/sd/877580616_sd.pdf; MPN: 87758-0216; OC_FARNELL: unknown; OC_NEWARK: 94M1513
X7 = microbuilder:ANTENNA_JOHANSON_2450AT18B100: Johanson 2.4GHz Chip Antenna (1206 Package) Frequency Range: 2400 - 2500 Mhz Peak Gain 0.5 dBi typ. (XZ-V) Average Gain -0.5 dBi typ. (XZ-V) Input Power 3W max. Operating Temperature -40 to +85°C Digikey: 712-1006-1-ND
X8 = microbuilder:SIM_LOCK: C707A SIMLOCK® 2.5 mm with wide solder tails Source: Data sheet <http://www.amphenol.info/downloads/C707_10M006_512_2.pdf>; OC_FARNELL: unknown; OC_NEWARK: unknown

## Net classes
0 default: width 0.203 mm, drill 0.305 mm
1 power: width 0.305 mm, drill 0.508 mm
2 gnd: width 0.61 mm, drill 0.508 mm, clearance 0.203 mm
3 usbvcc: width 0.508 mm, drill 0.508 mm, clearance 0.152 mm
4 aref: width 0.406 mm

## Board
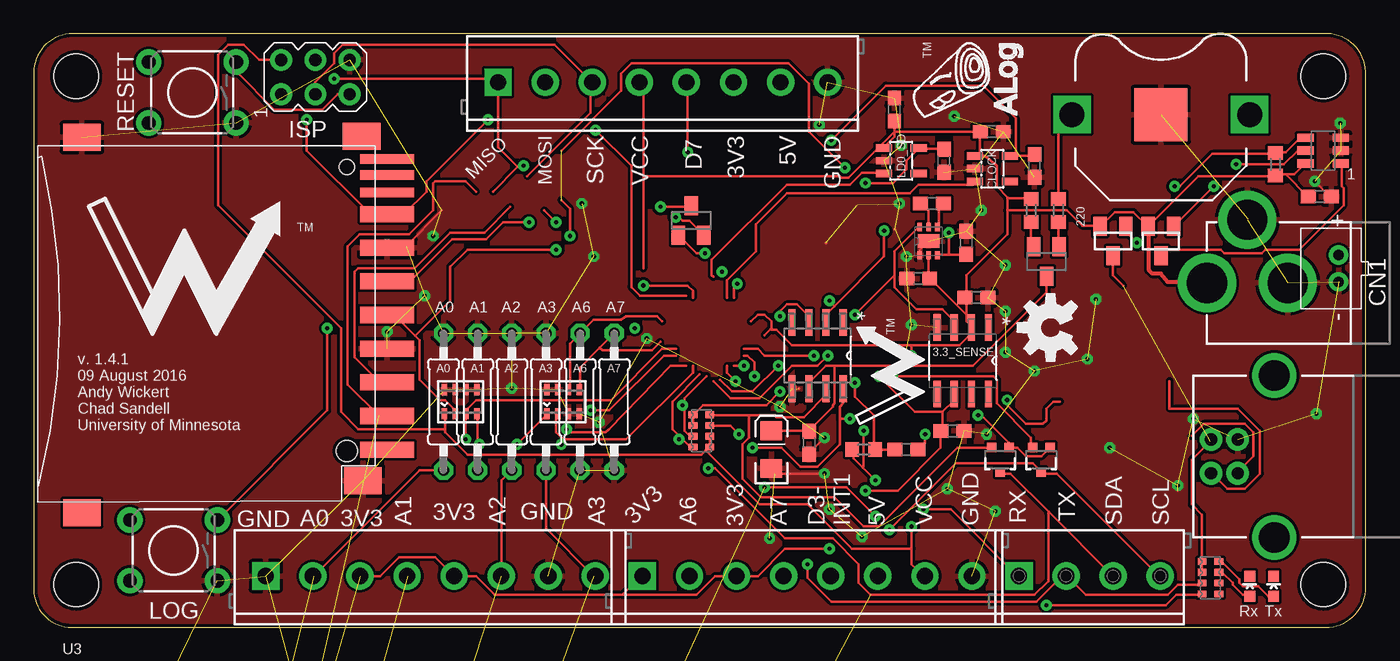
[diagram p3: board, top side]
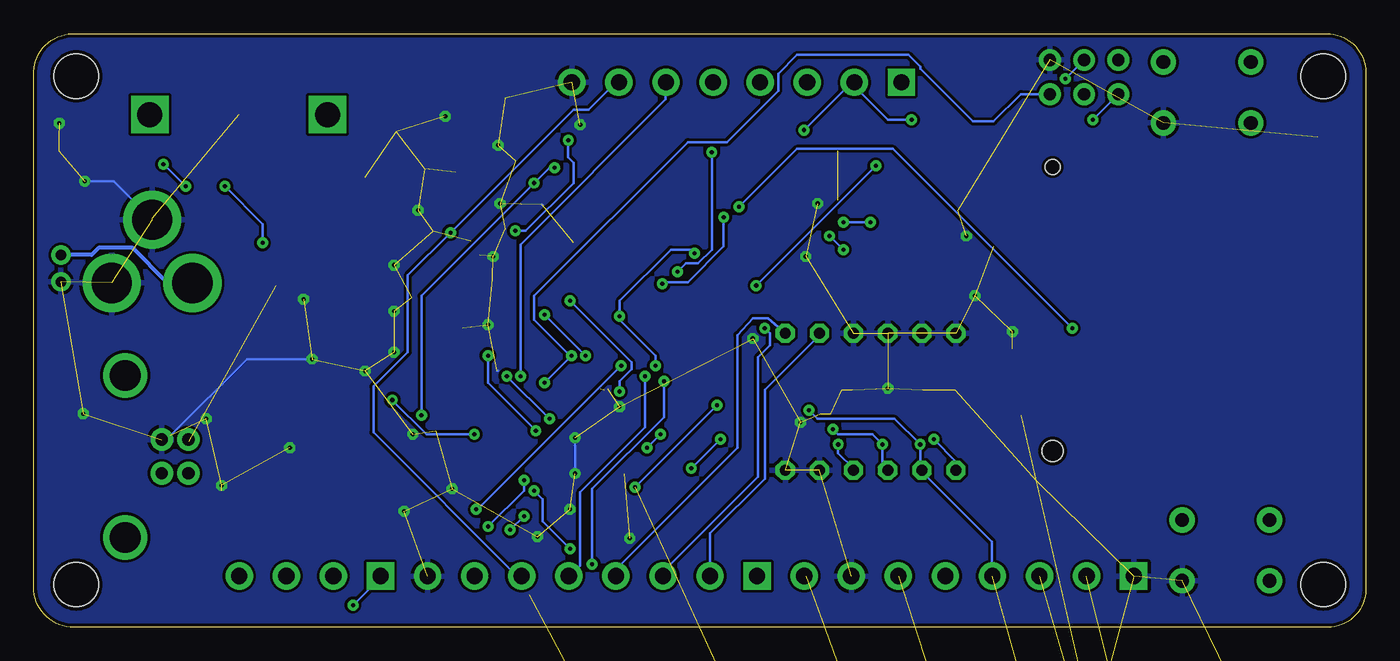
[diagram p4: board, bottom side, seen from below]

Size 99.05 x 44.12 mm. Coordinates in mm from the lower left corner, seen from the top.
Outline: 99.05,41.32 arc90 95.93,44.12 2.91,44.12 arc90 0,41.21 0,2.85 arc90 2.85,0 96.06,0 arc90 99.05,2.98 99.05,41.32
Copper layers (1*16): Top 0.035mm / dielectric 1.5mm / Bottom 0.035mm
Design rules "SparkFun *": minimum track width 8mil, minimum drill 12mil, track to track 8mil, track to pad 8mil, pad to pad 8mil, via to via 8mil, smd to smd 8mil, copper to edge 10mil, drill to drill 8mil, minimum pad ring 12mil, minimum via ring 10mil, stop-mask expansion 4mil, vias tented up to drill 25mil, thermal gap 10mil

### Footprints (pad centres in the part's own frame; a part is rotated, then mirrored left to right if it is on the bottom)
SOIC127P600X175-8N = smd 1.981 x 0.533: 1 -2.464,1.905; 2 -2.464,0.635; 3 -2.464,-0.635; 4 -2.464,-1.905; 5 2.464,-1.905; 6 2.464,-0.635; 7 2.464,0.635; 8 2.464,1.905
SON65P200X200X80-7N = smd 0.61 x 0.356: 1 -1.041,0.66; 2 -1.041,0; 3 -1.041,-0.66; 4 1.041,-0.66; 5 1.041,0; 6 1.041,0.66 | smd 0.991 x 1.6: 7 0,0
0207/10 = drill 0.813 octagon: 1 -5.08,0; 2 5.08,0
1X01-CLEANBIG = drill 1.016 pad 1.778: 1 0,0
_0805MP = smd 1.2 x 1.3: 1 -1.016,0; 2 1.016,0
0603-NO = smd 1.1 x 1: 1 -0.85,0; 2 0.85,0
0805-NO = smd 1.3 x 1.5: 1 -0.95,0; 2 0.95,0
CECJ-1206 = smd 0.406 x 0.813: A1 -1.2,-0.9; A2 -1.2,0.9; B1 -0.4,-0.9; B2 -0.4,0.9; C1 0.4,-0.9; C2 0.4,0.9; D1 1.2,-0.9; D2 1.2,0.9
C0603 = smd 1.1 x 1: 1 -0.85,0; 2 0.85,0
SOT23-5L = smd 0.55 x 1.2: 1 -0.95,-1.3; 2 0,-1.3; 3 0.95,-1.3; 4 0.95,1.3; 5 -0.95,1.3
BATTCON_12MM_PTH = smd 3.962 x 3.962: GND 0,0 | drill 1.854 square: VCC@1 -6.604,0; VCC@2 6.604,0
EIA3216 = smd 1.4 x 1.6: A 1.4,0; C -1.4,0
JST-PH-2-THM = drill 0.8 pad 1.422: 1 1,0; 2 -1,0
SOT23C = smd 1 x 1.4: 1 -0.95,-1.1; 2 0.95,-1.1; 3 0,1.1
SOT363 = smd 0.5 x 0.5: 1 -0.75,-0.9; 3 0.75,-0.9; 4 0.75,0.9; 6 -0.75,0.9 | smd 0.4 x 0.5: 2 0,-0.9; 5 0,0.9
SOD-323 = smd 1.35 x 0.8: A 1.27,0; C -1.27,0
SCREWTERMINAL-3.5MM-8 = drill 1.2 pad 2.032 square: 1 0,0 | drill 1.2 pad 2.032: 2 3.5,0; 3 7,0; 4 10.5,0; 5 14,0; 6 17.5,0; 7 21,0; 8 24.5,0
TSOT23-6 = smd 0.622 x 1.22: 1 -0.95,-1.31; 2 0,-1.31; 3 0.95,-1.31; 4 0.95,1.31; 5 0,1.31; 6 -0.95,1.31
AVRISP = drill 0.9 pad 1.626: 1 -1.27,2.54; 2 1.27,2.54; 3 -1.27,0; 4 1.27,0; 5 -1.27,-2.54; 6 1.27,-2.54
POWER_JACK_PTH = drill 2.997 pad 4.318: GND 0,7.7; GNDBREAK 4.7,10.7; PWR 0,13.7
STAND-OFF = hole 3.302: 0,0
USB-B-PTH = drill 0.914 pad 1.676: D+ 0,1.25; D- 1.981,1.25; GND 0,-1.25; VBUS 1.981,-1.25 | drill 2.286: S1 -2.718,-6.02; S2 -2.718,6.02
SCREWTERMINAL-3.5MM-4 = drill 1.2 pad 2.032 square: 1 0,0 | drill 1.2 pad 2.032: 2 3.5,0; 3 7,0; 4 10.5,0
LED-0603 = smd 0.8 x 0.8: A 0,-0.75; C 0,0.75
TACTILE-PTH = drill 1.016 pad 1.88: 1 -3.251,2.261; 2 3.251,2.261; 3 -3.251,-2.261; 4 3.251,-2.261
SUPER-SOT3 = smd 1 x 1.4: 1 -0.95,-1.1; 2 0.95,-1.1; 3 0,1.1
SOT323 = smd 0.7 x 0.7: 1 -0.65,-0.925; 2 0.65,-0.925; 3 0,0.925
R0603 = smd 1 x 1.1: 1 -0.85,0; 2 0.85,0
0603-ARC = smd 0.5 x 0.65: 1 -1.2,-0.625; 2 -0.4,-0.625; 3 0.4,-0.625; 4 1.2,-0.625; 5 1.2,0.625; 6 0.4,0.625; 7 -0.4,0.625; 8 -1.2,0.625
06132 = smd 1.2 x 4: 1 6.9,0.9; 2 4.4,0.9; 3 1.9,0.9; 4 -0.6,0.9; 5 -3.1,0.9; 6 -5.6,0.9; 7 -8.1,0.9; 9 9.4,0.9 | smd 0.7 x 4: 8 -9.7,0.9; CD -11,0.9; WP -12.2,0.9 | smd 2 x 2.8: GP -13.8,-21.8; GP2 14.1,-21.8; GP3 11.7,-0.9; GP4 -13.9,-1 | hole 1.1: -11.6,-2.1 | hole 1.6: 9.5,-2.1
SOLDERJUMPER_CLOSEDWIRE = smd 1.168 x 1.6: 1 -0.762,0; 2 0.762,0 | smd 0.635 x 0.203: WIRE 0,0
TESTPOINT_ROUND_1.5MM = smd 1.5 x 1.5: P$1 0,0
21-0041B_8 = smd 1.981 x 0.533: 1 -2.464,1.905; 2 -2.464,0.635; 3 -2.464,-0.635; 4 -2.464,-1.905; 5 2.464,-1.905; 6 2.464,-0.635; 7 2.464,0.635; 8 2.464,1.905
SIM800L = smd 1.1 x 0.9: 1 -8.1,5.6; 2 -8.1,4.2; 3 -8.1,2.8; 4 -8.1,1.4; 5 -8.1,0; 6 -8.1,-1.4; 7 -8.1,-2.8; 8 -8.1,-4.2; 9 -8.1,-5.6; 22 8.1,-5.6; 23 8.1,-4.2; 24 8.1,-2.8; 25 8.1,-1.4; 26 8.1,0; 27 8.1,1.4; 28 8.1,2.8; 29 8.1,4.2; 30 8.1,5.6; 43 -6.36,5.6; 44 -6.36,4.2; 45 -6.36,2.8; 46 -6.36,1.4; 47 -6.36,0; 48 -6.36,-1.4; 49 -6.36,-2.8; 50 -6.36,-4.2; 51 -6.36,-5.6; 60 6.36,-5.6; 61 6.36,-4.2; 62 6.36,-2.8; 63 6.36,-1.4; 64 6.36,0; 65 6.36,1.4; 66 6.36,2.8; 67 6.36,4.2; 68 6.36,5.6 | smd 0.9 x 1.1: 10 -7.7,-7.1; 11 -6.3,-7.1; 12 -4.9,-7.1; 13 -3.5,-7.1; 14 -2.1,-7.1; 15 -0.7,-7.1; 16 0.7,-7.1; 17 2.1,-7.1; 18 3.5,-7.1; 19 4.9,-7.1; 20 6.3,-7.1; 21 7.7,-7.1; 31 7.7,7.1; 32 6.3,7.1; 33 4.9,7.1; 34 3.5,7.1; 35 2.1,7.1; 36 0.7,7.1; 37 -0.7,7.1; 38 -2.1,7.1; 39 -3.5,7.1; 40 -4.9,7.1; 41 -6.3,7.1; 42 -7.7,7.1; 52 -4.9,-5.5; 53 -3.5,-5.5; 54 -2.1,-5.5; 55 -0.7,-5.5; 56 0.7,-5.5; 57 2.1,-5.5; 58 3.5,-5.5; 59 4.9,-5.5; 69 4.9,5.5; 70 3.5,5.5; 71 2.1,5.5; 72 0.7,5.5; 73 -0.7,5.5; 74 -2.1,5.5; 75 -3.5,5.5; 76 -4.9,5.5 | smd 1.5 x 1.5: 77 -3.9,3 | smd 2.3 x 2.7: 78 -3.9,0; 79 -3.9,-3; 80 -1.3,-3; 81 1.3,-3; 82 3.9,-3; 83 3.9,0; 84 3.9,3; 85 1.3,3; 86 -1.3,3; 87 -1.3,0; 88 1.3,0
SIM900_SMT = smd 2 x 0.6: P$1 -12.4,8; P$2 -12.4,7; P$3 -12.4,6; P$4 -12.4,5; P$5 -12.4,4; P$6 -12.4,3; P$7 -12.4,2; P$8 -12.4,1; P$9 -12.4,0; P$10 -12.4,-1; P$11 -12.4,-2; P$12 -12.4,-3; P$13 -12.4,-4; P$14 -12.4,-5; P$15 -12.4,-6; P$16 -12.4,-7; P$17 -12.4,-8; P$35 12.4,-8; P$36 12.4,-7; P$37 12.4,-6; P$38 12.4,-5; P$39 12.4,-4; P$40 12.4,-3; P$41 12.4,-2; P$42 12.4,-1; P$43 12.4,0; P$44 12.4,1; P$45 12.4,2; P$46 12.4,3; P$47 12.4,4; P$48 12.4,5; P$49 12.4,6; P$50 12.4,7; P$51 12.4,8 | smd 0.6 x 2: P$18 -8,-12.4; P$19 -7,-12.4; P$20 -6,-12.4; P$21 -5,-12.4; P$22 -4,-12.4; P$23 -3,-12.4; P$24 -2,-12.4; P$25 -1,-12.4; P$26 0,-12.4; P$27 1,-12.4; P$28 2,-12.4; P$29 3,-12.4; P$30 4,-12.4; P$31 5,-12.4; P$32 6,-12.4; P$33 7,-12.4; P$34 8,-12.4; P$52 8,12.4; P$53 7,12.4; P$54 6,12.4; P$55 5,12.4; P$56 4,12.4; P$57 3,12.4; P$58 2,12.4; P$59 1,12.4; P$60 0,12.4; P$61 -1,12.4; P$62 -2,12.4; P$63 -3,12.4; P$64 -4,12.4; P$65 -5,12.4; P$66 -6,12.4; P$67 -7,12.4; P$68 -8,12.4
TQFN48_7MM = smd 0.25 x 0.75: 1 -2.75,-3.475; 2 -2.25,-3.475; 3 -1.75,-3.475; 4 -1.25,-3.475; 5 -0.75,-3.475; 6 -0.25,-3.475; 7 0.25,-3.475; 8 0.75,-3.475; 9 1.25,-3.475; 10 1.75,-3.475; 11 2.25,-3.475; 12 2.75,-3.475; 25 2.75,3.475; 26 2.25,3.475; 27 1.75,3.475; 28 1.25,3.475; 29 0.75,3.475; 30 0.25,3.475; 31 -0.25,3.475; 32 -0.75,3.475; 33 -1.25,3.475; 34 -1.75,3.475; 35 -2.25,3.475; 36 -2.75,3.475 | smd 0.75 x 0.25: 13 3.475,-2.75; 14 3.475,-2.25; 15 3.475,-1.75; 16 3.475,-1.25; 17 3.475,-0.75; 18 3.475,-0.25; 19 3.475,0.25; 20 3.475,0.75; 21 3.475,1.25; 22 3.475,1.75; 23 3.475,2.25; 24 3.475,2.75; 37 -3.475,2.75; 38 -3.475,2.25; 39 -3.475,1.75; 40 -3.475,1.25; 41 -3.475,0.75; 42 -3.475,0.25; 43 -3.475,-0.25; 44 -3.475,-0.75; 45 -3.475,-1.25; 46 -3.475,-1.75; 47 -3.475,-2.25; 48 -3.475,-2.75 | smd 4.7 x 4.7: THERMAL 0,0
XTAL3215 = smd 1.1 x 1.9: P$1 1.2,0; P$2 -1.2,0
U.FL = smd 2.2 x 1.05: 1 0,1.375; 2 0,-1.375 | smd 0.8 x 1: 3 1.525,0
87758-0216 = drill 0.9 pad 1.27: 1 0,-1; 2 0,1
ANT_2450AT18B100 = smd 1.6 x 1.8: FP -1.4,0; NC 1.4,0
C707_10M006_512_2 = smd 1.7 x 1.3: C1 -12.85,-3.915; C2 -12.85,-1.375; C3 -12.85,1.165; C5 12.85,-3.915; C6 12.85,-1.375; C7 12.85,1.165

### Placement (x,y rotation side)
3.3_SENSE  69.08,19.81 270 top
5V_CHARGE_PUMP  66.54,28.7 90 top
A0  30.47,16.76 270 top
A1  33.01,16.76 270 top
A2  35.55,16.76 270 top
A3  38.09,16.76 270 top
A6  40.63,16.76 270 top
A7  43.17,16.76 270 top
ADC1  10.28,-34.42 0 top  (outside the outline)
C1  -18.55,-139.19 0 top  (outside the outline)
C2  -13.09,-155.19 0 top  (outside the outline)
C3  -19.06,-160.53 0 top  (outside the outline)
C4  -13.98,-160.53 0 top  (outside the outline)
C9  26.02,-31.88 0 top  (outside the outline)
C14  31.74,16.76 0 top
C15  39.36,16.76 0 top
C_BOOST_1  65.78,25.91 0 top
C_BOOST_2  66.79,31.5 0 top
C_BOOST_3  69.33,28.57 270 top
C_LDO_CLOCK  74.41,34.29 90 top
C_LDO_SD  67.68,34.67 90 top
C_LDO_SENSE  68.32,14.61 180 top
CLOCK  71.28,34.09 270 top
CLOCK_BATT  83.81,38.1 0 top
CLOCK_BATT_DECOUP  57.65,13.72 270 top
CLOCK_BATT_DECOUPLE  54.85,13.21 90 top
CLOCK_CIN  71.24,36.83 0 top
CN1  97.02,26.67 90 top
COUT  95.62,32 0 top
COUT1  64.89,13.21 180 top
D1  75.3,27.18 180 top
D2  48.89,30.23 0 top
D3  -18.93,-78.49 0 top  (outside the outline)
D4  -14.62,-130.68 0 top  (outside the outline)
D5  -10.42,-130.68 0 top  (outside the outline)
D7  -6.23,-130.68 0 top  (outside the outline)
D9  -2.04,-130.68 0 top  (outside the outline)
H0  17.26,3.81 0 top
H1  45.26,3.81 0 top
H3  34.53,40.51 0 top
IC1  95.88,35.43 90 top
ISP  20.94,40.89 90 top
J1  100.94,25.59 90 top
JP1  3.17,3.17 0 top
JP2  95.88,40.96 90 top
JP3  95.88,3.17 90 top
JP4  3.17,40.96 0 top
JP5  89.52,12.7 180 top
JP6  73.26,3.81 0 top
LD0_SD  64.51,34.67 270 top
LED1  90.41,3.05 0 top
LED2  92.19,3.05 0 top
LOG  10.4,5.71 180 top
LOGO1  75.61,22.27 90 top
Q1  83.81,28.7 180 top
Q2  80.25,28.7 180 top
Q3  71.87,12.45 180 top
Q4  74.92,12.45 180 top
R6  0.88,-39.62 0 top  (outside the outline)
R9  -0.52,-138.18 0 top  (outside the outline)
R_RESET  61.71,13.21 180 top
RCKL1  74.16,30.99 90 top
RCLK2  76.19,30.99 90 top
RESET  11.8,39.75 180 top
RN1  87.49,3.68 90 top
RN2  49.65,14.61 90 top
RSTAT  92.32,34.42 270 top
SD  25.39,22.61 270 top
SD_CIN  64,38.48 90 top
SENSE_CIN  70.09,24.51 0 top
SJ1  -14.62,-139.57 0 top  (outside the outline)
TP1  -19.57,-142.11 0 top  (outside the outline)
TP2  -19.57,-162.94 0 top  (outside the outline)
TP3  -14.87,-162.94 0 top  (outside the outline)
U1  58.28,20.19 270 top
U2  -10.42,-119.38 0 top  (outside the outline)
U3  13.58,-17.27 0 top  (outside the outline)
U$1  11.17,26.42 0 top
U$2  68.32,40.77 90 top
U$3  63.24,18.67 90 top
U$21  -16.39,-148.84 0 top  (outside the outline)
X1  -17.54,-156.72 0 top  (outside the outline)
X3  1.01,-34.8 0 top  (outside the outline)
X4  -18.81,-106.17 0 top  (outside the outline)
X5  -0.14,-114.17 0 top  (outside the outline)
X6  -19.44,-132.72 0 top  (outside the outline)
X7  -10.3,-138.3 0 top  (outside the outline)
X8  -6.87,-206.76 0 top  (outside the outline)

### Tracks (layer width: path | path; a pad name or v marks a point on that pad's centre or on a via)
1.8V  (3 unrouted)
2.8V  (2 unrouted)
4_RST  (1 unrouted)
5V  (via drill 0.3)
  Top 0.203: 68.06,27.69 69.33,27.69 C_BOOST_3.2 | 68.06,27.69 67.3,27.69 5V_CHARGE_PUMP.3 | v68.06,29.34 68.06,27.69
  Bottom 0.203: H3.7 55.74,40.51 57.77,38.48 58.92,38.48 v68.06,29.34 71.24,26.16 71.24,20.45 73.78,17.91 73.78,14.48 63.11,3.81 H1.6
+3V3  (via drill 0.3)  (4 unrouted)
  Top 0.203: H0.3 25.77,3.81 27.17,5.21 29.83,5.21 31.23,3.81 H0.5 32.88,3.81 34.28,2.41 43.8,2.41 43.87,2.48 | 43.87,2.48 45.2,3.81 H1.1 | 67.55,16 67.55,14.61 C_LDO_SENSE.2 67.43,14.61 67.43,13.34 64.25,10.16 v61.84,10.16 | 67.55,16 68.44,16.89 3.3_SENSE.6 | v62.86,18.67 65.52,16 67.55,16 | 43.87,2.48 43.93,2.41 49.27,2.41 50.66,3.81 H1.3 53.84,3.81 55.87,5.84 v59.17,5.84
  Bottom 0.203: v62.86,18.67 62.86,28.45 52.06,39.24 52.06,40.51 H3.6 | v44.69,22.23 44.31,21.84 44.31,20.95 45.2,20.07 45.2,11.18 52.19,4.19 52.19,3.81 H1.3 | v59.17,5.84 61.2,7.87 61.2,9.53 v61.84,10.16
A0  (via drill 0.3)  (1 unrouted)
  Top 0.203: 47.74,20.7 46.73,20.7 42.92,16.89 32.88,16.89 32.25,16.26 32.25,15.88 C14.C1 32.12,15.75 v32.12,13.97 | A0.2 28.69,11.68 20.82,3.81 H0.2
  Bottom 0.203: v32.12,13.97 30.47,12.32 A0.2
A1  (via drill 0.3)  (1 unrouted)
  Top 0.203: v33.14,13.59 33.01,13.72 33.01,15.75 C14.D1 | 47.74,20.19 46.85,20.19 42.79,16.13 v41.39,16.13
  Bottom 0.203: v41.39,16.13 40.76,15.49 35.04,15.49 v33.14,13.59 33.14,11.81 A1.2 33.14,11.68 27.8,6.35 27.8,3.81 H0.4
A2  (via drill 0.3)  (1 unrouted)
  Top 0.203: v35.93,13.59 38.09,15.75 C15.A1 | 48.5,19.43 47.36,19.43 42.79,14.73 42.54,14.48 39.87,14.48 v39.61,14.73 | A2.2 34.79,10.92 34.79,3.81 H0.6
  Bottom 0.203: A2.2 35.93,12.06 v35.93,13.59 36.69,14.35 39.23,14.35 v39.61,14.73
A3  (via drill 0.3)  (1 unrouted)
  Top 0.203: 39.3,14.03 39.36,13.97 44.06,13.97 49.01,18.92 49.01,19.43 | 39.3,14.03 38.85,14.48 38.85,15.75 C15.B1 | A3.2 38.09,7.37 41.65,3.81 H0.8 | v39.23,13.59 39.23,13.97 39.3,14.03
  Bottom 0.203: v39.23,13.59 39.23,12.95 38.09,11.81 A3.2
A6
  Top 0.203: C15.C2 39.87,17.78 39.87,21.08 A6.1 41.65,22.86 43.68,22.86 44.06,23.11 46.34,23.11 46.73,22.73
  Bottom 0.203: A6.1 40.63,21.72 44.69,17.65 44.69,11.05 48.76,6.99 H1.2
A7
  Top 0.203: A7.1 42.09,20.77 | 42.09,20.77 40.63,19.3 40.63,17.78 C15.D2 | 46.6,21.21 45.96,20.57 42.28,20.57 42.09,20.77
  Bottom 0.203: A7.1 44.44,22.99 45.58,22.99 46.73,21.72 46.73,13.34 55.74,4.32 55.74,3.81 H1.4
BAT
  Top 0.203: 57.65,14.61 CLOCK_BATT_DECOUPLE.A | D1.3 75.3,24.89 69.84,19.43 59.55,19.43 | 59.55,19.43 58.92,19.43 57.65,18.16 U1.6 | 57.65,14.61 59.43,16.38 59.43,16.51 59.55,16.64 59.55,19.43 | 57.65,14.61 CLOCK_BATT_DECOUP.1
BATTERY_POWER
  Top 0.203: IC1.1 97.27,34.42 97.27,32.77 97.4,32.64 97.4,31.37 94.1,28.07 91.56,28.07 91.3,27.81 88.51,27.81 88.25,28.07 84.19,28.07 83.81,27.69 Q1.3
CLK
  Top 0.203: ISP.3 20.94,40.51 22.34,41.91 22.34,42.67 22.98,43.31 38.73,43.31 H3.3 41.39,40.51 41.39,38.23 36.69,33.53
D3-INT1  (via drill 0.3)
  Top 0.203: 52.82,20.19 53.08,20.19 53.58,19.68 v53.58,18.67
  Bottom 0.203: v53.58,18.67 53.58,14.86 58.41,10.03 58.41,4.57 59.17,3.81 H1.5
D4-SENSE_LDO_SWITCH  (via drill 0.3)
  Top 0.203: 64,26.16 64,25.27 65.65,23.62 67.55,23.62 68.44,22.73 3.3_SENSE.3 | 64,26.16 64,27.94 65.78,29.72 5V_CHARGE_PUMP.6 | 52.82,20.7 53.84,20.7 54.35,20.19 v58.03,20.19 | 64,26.16 v61.08,23.24
  Bottom 0.203: v61.08,23.24 v58.03,20.19
D5_MANUAL_LOG  (via drill 0.3)
  Top 0.203: 52.06,24.51 52.06,25.27 v52.31,25.53 | v47.74,30.48 48,30.48 48.25,30.23 48.76,30.23 49.77,29.21 D2.2
  Bottom 0.203: v52.31,25.53 52.19,25.65 50.41,25.65 47.74,28.32 v47.74,30.48
D6-CLOCK_3V3_SWITCH
  Top 0.203: 51.55,24.51 51.55,25.78 53.71,27.94 53.71,29.97 56,32.26 65.14,32.26 65.78,32.89 69.84,32.89 69.97,33.02 CLOCK.3
D7-CS-EXT  (via drill 0.3)
  Top 0.203: v51.17,26.42 51.04,26.29 | v48.63,35.31 48.63,40.51 H3.5
  Bottom 0.203: v51.17,26.42 50.54,27.05 49.65,27.05 48.63,28.07 v48.63,35.31
D8-SD_3V3_SWITCH
  Top 0.203: 50.54,26.04 50.41,26.16 50.41,27.3 56,32.89 60.7,32.89 61.59,33.78 63.11,33.78 LD0_SD.3
DI  (via drill 0.3)
  Top 0.203: v22.34,40.77 34.28,40.77 H3.1 34.53,35.69 36,34.23 | 49.01,24.51 49.01,25.02 48.63,25.4 v45.33,25.4 | v36.44,34.29 36.06,34.29 36,34.23 | 34.15,32.38 36,34.23
  Bottom 0.203: v22.34,40.77 ISP.4 | v36.44,34.29 v45.33,25.4
DTR  (via drill 0.3)
  Top 0.203: 76.32,16.76 75.81,16.76 75.3,16.26 75.3,15.37 75.05,15.11 73.78,15.11 72.38,16.51 v72.38,16.89 | v66.28,14.35 66.28,13.72 65.78,13.21 COUT1.1
  Bottom 0.203: v72.38,16.89 69.84,14.35 v66.28,14.35
FM_ANT  (1 unrouted)
GND  (via drill 0.3)  (146 unrouted)
  Top 0.203: v95.24,33.15 96.38,32 COUT.2 | 30.34,30.99 27.68,28.32 26.41,28.32 SD.6 | 5V_CHARGE_PUMP.7 65.9,28.07 65.9,27.69 5V_CHARGE_PUMP.1 | v58.79,14.1 57.65,12.95 CLOCK_BATT_DECOUP.2 | v58.79,11.43 55.11,11.43 54.85,11.68 CLOCK_BATT_DECOUPLE.C | 56.89,17.78 56.89,17.73 | U1.5 56.63,17.65 56.63,17.91 U1.5 | U1.5 | 56.51,17.78 U1.5 | 64,29.59 64.05,29.59 | 58.92,28.57 58.89,28.55 | 85.08,10.16 85.08,10.15 | 78.38,19.91 v78.35,19.94 | U1.5 56.38,17.78 U1.5
  Bottom 0.203: v95.24,33.15 93.08,33.15 90.29,30.35 J1.GNDBREAK | v58.79,11.43 v58.79,14.1 | 64.51,19.05 64.58,19.08 | 61.2,31.37 61.25,31.41 | v78.35,19.94 83.17,19.94 88.89,14.22 89.14,14.22 JP5.GND
  Bottom 1.016: JP5.GND 89.55,13.95
  other vias: 26.28,21.97 29.71,29.08 40.76,31.5 55.49,16.38 64.38,31.5 72.25,23.5 70.47,30.99 64.89,27.56 65.27,22.48 72.25,26.92 74.41,19.05 70.86,14.35 72.25,20.45 58.41,37.34 64.51,35.81 68.44,37.97 78.98,24.38 67.93,10.29 71.49,8.64 97.14,37.47 95.37,15.88 86.22,15.49 80,13.34 85.08,10.54 45.58,21.46 29.07,24.64 61.59,6.73 59.17,8.76 41.65,27.56 54.73,6.6 42.03,15.24 35.55,17.78
  pour Bottom: -0.33,44.45 -0.33,-0.32 99.37,-0.32 99.37,44.45
  pour Top: -0.65,44.77 -0.65,-0.64 99.68,-0.64 99.68,44.77
GSM_ANT  (2 unrouted)
INT0  (via drill 0.3)
  Top 0.203: v52.82,19.43 52.06,19.43 | v55.49,23.11 55.49,23.5 56,24 56.76,24 57.65,23.11 U1.3 | v49.9,27.81 49.27,27.81 48,29.08 D2.1
  Bottom 0.203: v52.82,19.43 52.82,20.19 55.49,22.86 v55.49,23.11 55.49,24.26 51.68,28.07 50.16,28.07 v49.9,27.81
KEY  (1 unrouted)
MIC2+  (1 unrouted)
MIC2-  (1 unrouted)
N$1
  Top 0.203: RCLK2.1 76.19,28.32 D1.1
N$2
  Top 0.203: RCLK2.2 76.19,37.08 CLOCK_BATT.VCC@1
N$3
  Top 0.203: 86.1,14.22 86.98,15.11 90.03,15.11 90.67,14.48 90.67,12.7 89.52,11.56 JP5.D+
N$4
  Top 0.203: 84.44,18.29 84.44,16.26 89.52,16.26 91.18,14.61 91.18,11.43 90.03,10.29 88.76,10.29 87.62,11.43 JP5.D-
N$5
  Top 0.203: LED2.A 91.8,2.3 91.05,3.05 89.91,3.05 89.65,3.3 89.65,3.56 88.38,4.83 88.13,4.83 RN1.4
N$6  (1 unrouted)
N$7  (via drill 0.3)
  Top 0.203: IC1.4 94.48,36.32 94.1,36.32 93.08,35.31 92.32,35.31 RSTAT.1 92.32,35.18 87.62,35.18 85.21,32.77 v84.83,32.77 | v82.03,28.57 81.27,29.34 81.27,29.72 Q2.1
  Bottom 0.203: v82.03,28.57 82.03,29.97 v84.83,32.77
N$8  (via drill 0.3)
  Top 0.203: IC1.5 93.97,35.43 92.95,34.42 v89.4,34.42 | v87.75,32.77 84.83,29.84 Q1.1
  Bottom 0.203: v87.75,32.77 v89.4,34.42
N$9
  Top 0.203: RN1.3 88.13,4.06 88.38,4.06 89.14,3.3 89.14,3.17 89.91,2.41 90.41,2.41 LED1.A
N$10  (1 unrouted)
N$11  (via drill 0.3)
  Top 0.203: v46.6,31.24 48.89,31.24 D2.3 | v21.83,22.23 21.83,16.13 13.71,8 LOG.3
  Bottom 0.203: v46.6,31.24 42.28,35.56 35.17,35.56 v21.83,22.23
N$13  (1 unrouted)
N$14
  Top 0.203: 5V_CHARGE_PUMP.4 67.3,29.84 67.3,31.24 67.55,31.5 C_BOOST_2.2
N$15
  Top 0.203: 5V_CHARGE_PUMP.5 66.54,30.99 66.03,31.5 C_BOOST_2.1
N$16  (1 unrouted)
N$17  (2 unrouted)
N$19  (2 unrouted)
N$67
  Top 0.203: RCKL1.1 74.16,28.45 74.28,28.32 D1.2
NETSTAT  (1 unrouted)
PWRSTAT  (1 unrouted)
RESET  (via drill 0.3)
  Top 0.203: ISP.5 22.6,39.62 21.45,38.48 17.9,38.48 15.1,41.27 15.1,41.91 RESET.3 | 50.54,18.29 51.81,17.02 53.97,17.02 56.38,19.43 58.28,19.43 v59.05,20.19 | v61.08,18.16 61.08,17.14 62.47,15.75 62.47,13.21 R_RESET.1 COUT1.2
  Bottom 0.203: v61.08,18.16 v59.05,20.19 59.17,20.19 61.84,22.86 61.84,24.64 50.41,36.07 47.49,36.07 43.68,39.88 43.68,41.15 42.28,42.55 34.03,42.55 33.14,41.66 33.14,41.53 29.2,37.59 27.68,37.59 25.64,39.62 ISP.5
RTS  (1 unrouted)
RX-I  (via drill 0.3)
  Top 0.203: 86.86,2.41 84.95,2.41 84.19,1.65 v75.3,1.65 | 51.04,18.41 51.93,17.53 53.46,17.53 v55.36,19.43 | v66.16,8.76 68.19,8.76 73.14,3.81 JP6.1
  Bottom 0.203: v75.3,1.65 73.14,3.81 JP6.1 | v55.36,19.43 66.03,8.76 v66.16,8.76
SCL  (via drill 0.3)  (1 unrouted)
  Top 0.203: 48.38,16.51 48.38,17.02 50.03,18.67 | 48.38,16.51 48.38,14.61 48.76,14.22 49.01,14.22 RN2.7 | JP6.4 83.68,3.81 76.06,11.43 74.92,11.43 Q4.3 74.92,11.56 74.28,12.19 68.57,12.19 v63.62,7.24 | v48.25,16.51 48.38,16.51 | v54.35,10.41 60.44,10.41 v62.6,8.26
  Bottom 0.203: v54.35,10.41 v48.25,16.51 | v63.62,7.24 v62.6,8.26
SCL_3V3  (via drill 0.3)
  Top 0.203: v52.44,14.35 51.81,14.99 50.28,14.99 RN2.3 | v53.46,13.34 55.62,13.34 57.01,11.94 58.28,11.94 59.93,13.59 59.93,15.49 | 59.93,15.49 59.93,16.38 60.19,16.64 U1.8 | v63.87,18.67 71.36,18.67 71.62,18.41 71.62,16.64 74.16,14.1 74.16,13.46 Q4.2 | 59.93,15.49 v60.7,15.49
  Bottom 0.203: v53.46,13.34 v52.44,14.35 | v60.7,15.49 v63.87,18.67
SD_CLK  (via drill 0.3)
  Top 0.203: v38.85,30.1 37.96,30.99 | v36.82,30.1 34.91,30.1 33.65,28.83 31.1,28.83 28.06,25.78 26.41,25.78 SD.5
  Bottom 0.203: v36.82,30.1 v38.85,30.1
SD_CS  (1 unrouted)
  Top 0.203: 32.88,32.38 32.12,33.15 29.83,33.15 29.71,33.02 29.71,30.99 27.93,29.21 24.25,29.21 23.36,28.32 23.36,18.03 25.64,15.75 26.28,15.75 SD.1
SD_DI
  Top 0.203: 35.42,31.24 33.52,29.34 30.98,29.34 28.31,26.67 24.12,26.67 23.87,26.42 23.87,20.07 25.64,18.29 26.28,18.29 SD.2
SD_DO  (via drill 0.3)
  Top 0.203: v20.31,37.72 20.31,35.43 25.01,30.73 26.28,30.73 SD.7 26.41,30.73 27.55,30.73 29.2,32.38 29.2,33.15 v33.77,37.72 | 48.5,24.64 45.08,24.64 44.44,25.27 44.44,34.29 v41.77,36.96
  Bottom 0.203: v20.31,37.72 ISP.1 | v41.77,36.96 38.22,40.51 H3.2 38.22,40.39 35.55,37.72 v33.77,37.72
SDA  (via drill 0.3)  (1 unrouted)
  Top 0.203: 48.06,14.16 47.49,14.73 47.49,16.76 49.52,18.8 | 48.06,14.16 48.76,13.46 49.01,13.46 RN2.8 | 75.49,8.57 JP6.3 | 75.49,8.57 72.63,11.43 71.87,11.43 Q3.3 | v48,13.97 48,14.1 48.06,14.16 | v50.16,11.81 50.66,11.81 55.87,6.6 59.43,6.6 61.33,4.7 61.33,3.3 62.22,2.41 74.41,2.41 75.43,3.43 75.43,8.51 75.49,8.57
  Bottom 0.203: v50.16,11.81 v48,13.97
SDA_3V3
  Top 0.203: 53.2,15.75 55.11,15.75 55.23,15.62 57.27,15.62 58.92,17.27 U1.7 | 53.2,15.75 50.28,15.75 RN2.4 | 53.2,15.75 53.2,14.1 52.7,13.59 52.7,11.05 54.09,9.65 59.55,9.65 61.71,7.49 62.86,7.49 68.7,13.34 71.11,13.34 Q3.2
SIMCLK  (3 unrouted)
SIMDATA  (3 unrouted)
SIMRST  (3 unrouted)
SPEAKER2+  (1 unrouted)
SPEAKER2-  (1 unrouted)
SWCLK  (1 unrouted)
SWDIO  (1 unrouted)
TX-O  (via drill 0.3)
  Top 0.203: 86.86,3.17 85.08,3.17 84.32,2.41 78.22,2.41 76.82,3.81 JP6.2 76.44,3.81 74.54,1.91 59.3,1.91 57.52,3.68 v57.52,4.7 | 51.55,19.43 51.55,18.92 v52.19,18.29
  Bottom 0.203: v52.19,18.29 52.19,15.62 57.52,10.29 v57.52,4.7
UART_DTR  (1 unrouted)
UART_RTS  (1 unrouted)
UART_RXD  (2 unrouted)
VBAT  (4 unrouted)
VBUS  (1 unrouted)
VCC  (via drill 0.3)
  Top 0.203: RN2.2 50.28,14.1 50.28,13.46 RN2.1 50.16,13.34 49.96,13.14 | 5V_CHARGE_PUMP.2 66.54,25.91 C_BOOST_1.2 66.66,25.91 69.33,23.24 | 69.33,23.24 69.33,22.73 69.71,22.35 3.3_SENSE.2 69.71,21.84 68.82,20.95 65.27,20.95 | 69.33,23.24 69.33,24.51 | 45.33,33.53 45.33,40.26 45.08,40.51 H3.4 | 45.33,33.53 45.33,26.67 | 70.35,36.83 70.35,35.31 70.09,35.05 CLOCK.1 70.73,35.05 71.62,34.29 71.62,32.77 72.44,31.94 | 64,36.83 64,36.45 63.24,35.69 LD0_SD.1 | 64,36.83 SD_CIN.1 | 64,36.83 70.35,36.83 | 70.35,36.83 CLOCK_CIN.1 | 93.08,33.66 93.72,33.66 94.48,34.42 IC1.6 | 93.08,33.66 92.32,33.66 RSTAT.2 92.32,33.53 86.6,33.53 82.92,29.84 Q1.2 | 93.08,33.66 94.73,32 COUT.1 | 72.44,31.94 72.51,31.88 74.16,31.88 RCKL1.2 | 45.33,33.53 59.93,33.53 60.06,33.4 60.57,33.4 64,36.83 | 69.33,24.51 69.33,26.16 72.38,29.21 72.38,30.99 | 72.38,30.99 72.38,31.88 72.44,31.94 | 69.33,24.51 SENSE_CIN.1 | Q1.2 82.79,29.84 81.78,30.86 80.38,30.86 79.36,29.84 Q2.2 79.24,29.84 77.97,29.84 76.82,30.99 72.38,30.99 | 82.92,29.72 Q1.2 | 87.24,25.65 J1.PWR | 54.79,22.16 54.85,22.23 54.85,22.73 54.35,23.24 53.84,23.24 53.33,22.73 | 54.79,22.16 54.35,21.72 | 65.27,20.95 56.38,20.95 55.23,22.1 54.85,22.1 54.79,22.16 | v62.6,10.92 61.65,11.87 | 61.65,11.87 60.95,12.57 60.95,13.21 R_RESET.2 | 65.27,5.84 65.27,4.7 66.16,3.81 H1.7 | 65.27,5.84 v65.27,7.49 | v65.27,20.19 65.27,20.95 | v61.71,14.61 61.71,11.94 61.65,11.87 | 30.6,14.73 30.6,14.48 32.25,12.83 49.65,12.83 49.96,13.14 | 30.6,14.73 30.6,15.75 C14.A1 | ISP.2 16.75,42.16 15.61,43.31 14.47,43.31 13.71,42.55 13.71,31.37 22.85,22.23 22.85,16 24.12,14.73 30.6,14.73 | 65.27,5.84 60.82,5.84 57.52,9.14 53.97,9.14 49.96,13.14
  Top 0.305: 82.92,29.72 82.92,26.54 83.17,26.29 83.81,26.29 84.32,25.65 87.24,25.65
  Bottom 0.203: v62.6,10.92 62.6,10.16 v65.27,7.49 | v65.27,20.19 65.27,18.16 v61.71,14.61 | 97.02,27.69 CN1.1 | 87.37,25.65 J1.PWR
  Bottom 0.305: 97.02,27.69 94.73,27.69 94.22,28.19 91.68,28.19 89.14,25.65 87.37,25.65
VCL  (via drill 0.3)
  Top 0.203: RN2.6 49.01,15.11 49.01,15.75 RN2.5 49.14,15.88 49.77,16.51 54.47,16.51 v55.49,17.53 | 73.02,35.05 72.63,35.05 CLOCK.5 73.02,35.05 | 73.02,35.05 74.41,35.05 C_LDO_CLOCK.2 | 73.02,35.05 73.02,37.85 70.6,40.26 63.36,40.26 v59.3,36.2 | v63.24,29.46 63.24,27.56 59.55,23.88 | 59.55,23.88 58.92,23.24 U1.2 | 59.55,23.88 v59.17,24.26
  Bottom 0.203: v59.3,36.2 59.3,34.92 58.92,34.54 58.92,33.02 62.47,29.46 v63.24,29.46 | v55.49,17.53 55.49,18.29 54.6,19.18 54.6,19.68 v59.17,24.26
VDD  (via drill 0.3)  (1 unrouted)
  Top 0.203: Q4.1 75.55,13.34 74.92,12.7 73.78,12.7 73.14,13.34 72.63,13.34 Q3.1 72.51,13.46 72.51,13.72 70.47,15.75 v70.22,15.75 | C_LDO_SD.2 67.68,35.56 65.9,35.56 LD0_SD.5 65.78,35.56 64.89,34.67 64.89,34.04 63.87,33.02 v61.84,33.02 | 39.23,35.43 43.68,39.88 43.68,41.15 44.44,41.91 56.12,41.91 57.65,40.39 57.65,36.83 v60.32,34.16 | 28.37,21.65 26.91,23.11 26.41,23.11 SD.4 | 28.37,21.65 28.69,21.34 28.69,18.41 30.22,16.89 30.6,16.89 31.23,16.26 31.23,15.88 C14.B1 | 28.37,21.65 30.98,24.26 30.98,26.8 32.25,28.07 v38.85,28.07 | v39.87,29.08 39.87,31.11 39.23,31.75
  Bottom 0.203: v70.22,15.75 70.22,24.64 v61.84,33.02 60.7,34.16 v60.32,34.16 | v39.87,29.08 v38.85,28.07
VDDCORE  (1 unrouted)
VRTC  (3 unrouted)
VUSB  (1 unrouted)
  Top 0.203: RN1.6 86.86,4.19 86.86,4.83 RN1.5 86.86,4.95 86.86,8.38 86.1,9.14 86.1,12.45 87.49,13.84 | Q2.3 80.25,26.16 81.02,25.4

### Text on the board
tPlace: TM | MISO | MOSI | SCK | VCC | 3V3 | 5V | GND | D7 | 1 | TM | TM | A0 | A1 | A2 | A3 | A6 | A7 | v. 1.4.1 / 09 August 2016 / Andy Wickert / Chad Sandell / University of Minnesota | GND | A0 | 3V3 | A1 | 3V3 | A2 | GND | A3 | 3V3 | A6 | 3V3 | A7 | D3- / INT1 | 5V | VCC | GND | RX | TX | SDA | SCL | Rx | Tx